# EAGLE design cnc-controller (EAGLE 6.4)

## Sheet 1 of 6
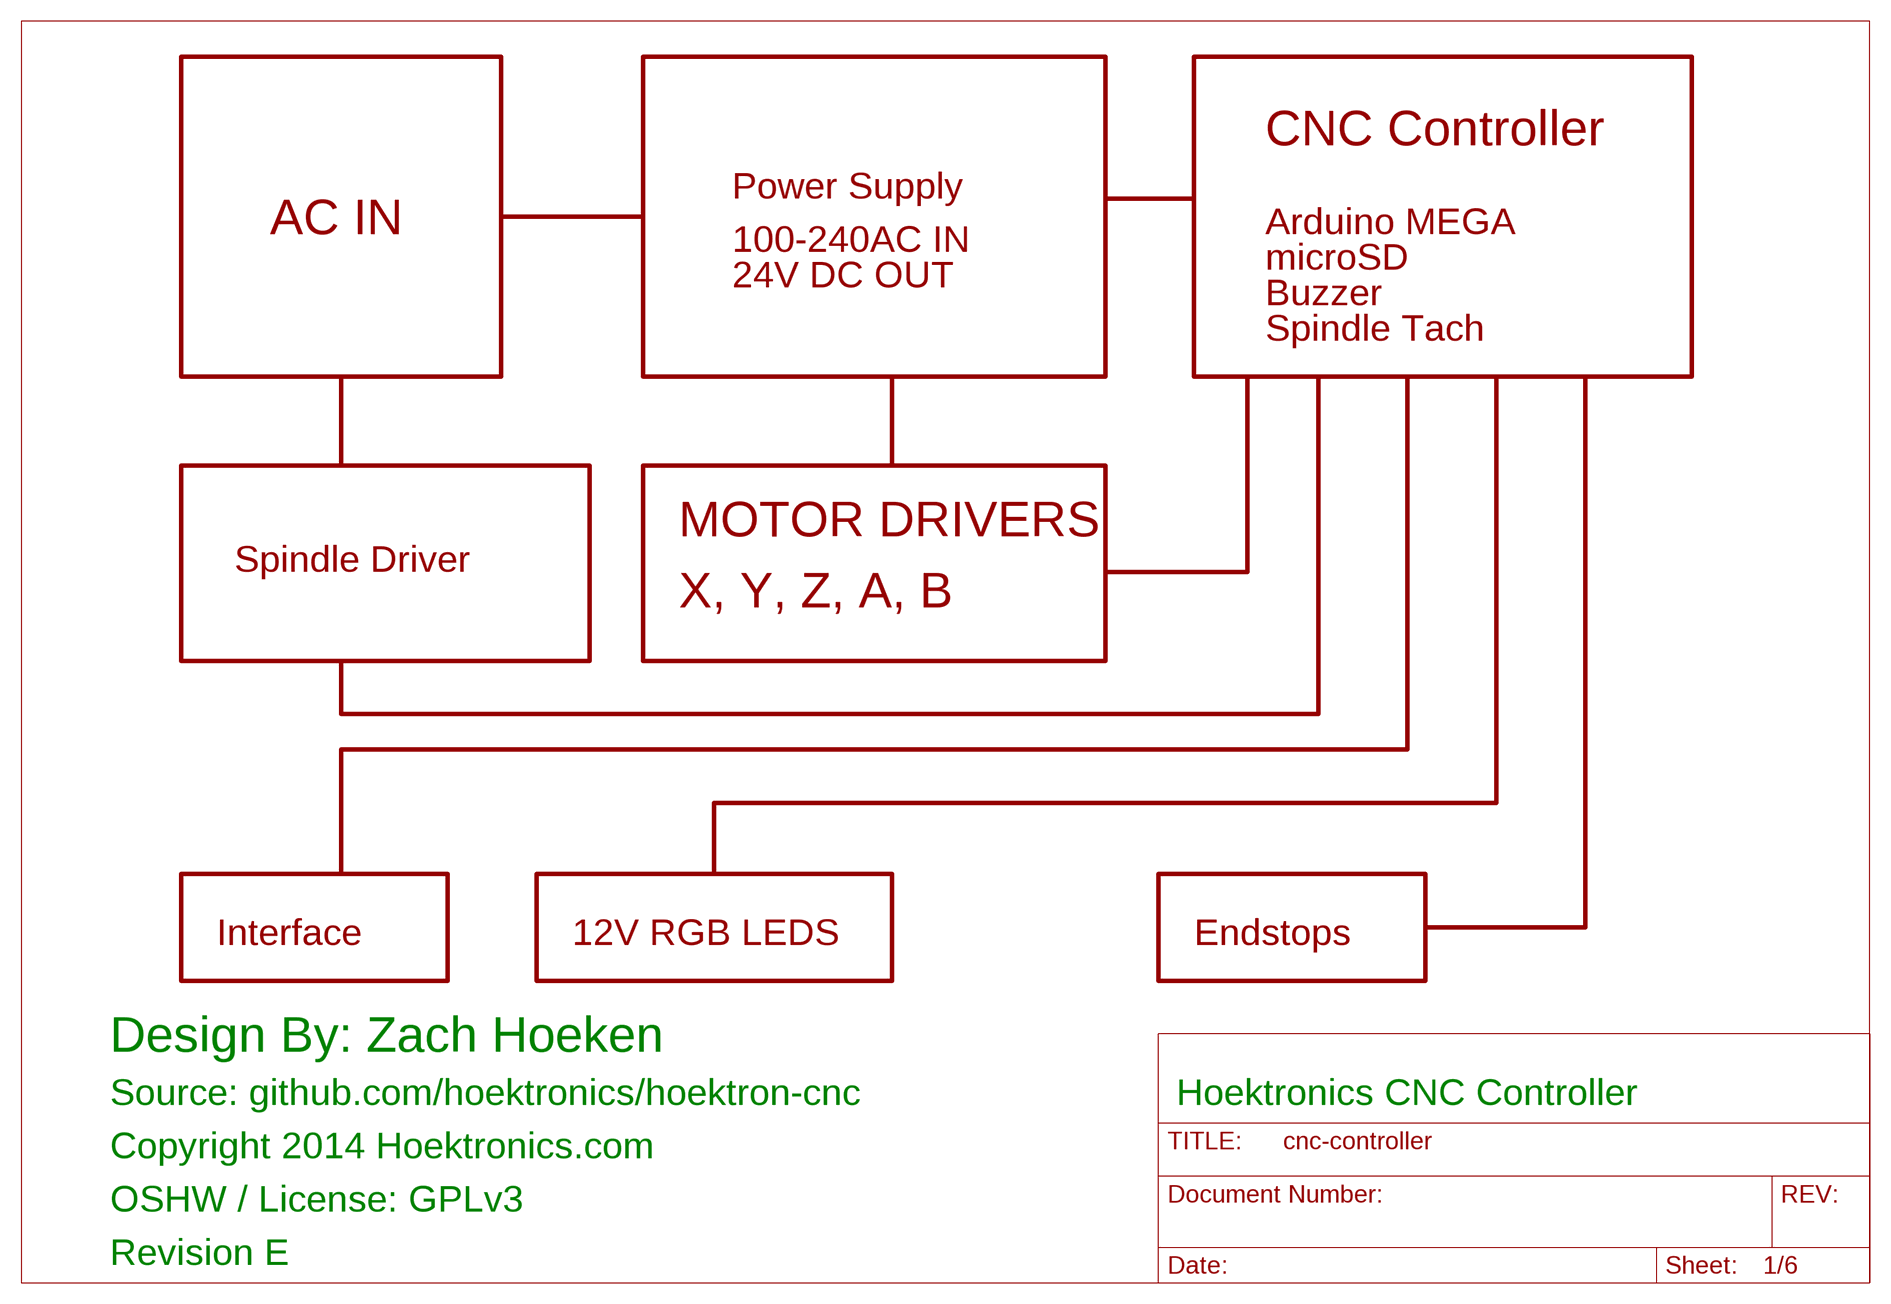
[diagram p0: schematic, sheet 1]

### Notes on the sheet
- CNC Controller
- Power Supply
- AC IN | Arduino MEGA
- 100-240AC IN
- microSD
- 24V DC OUT
- Buzzer
- Spindle Tach
- MOTOR DRIVERS
- Spindle Driver
- X, Y, Z, A, B
- Interface | 12V RGB LEDS | Endstops
- Design By: Zach Hoeken
- Source: github.com/hoektronics/hoektron-cnc | Hoektronics CNC Controller
- Copyright 2014 Hoektronics.com
- OSHW / License: GPLv3
- Revision E

## Sheet 2 of 6
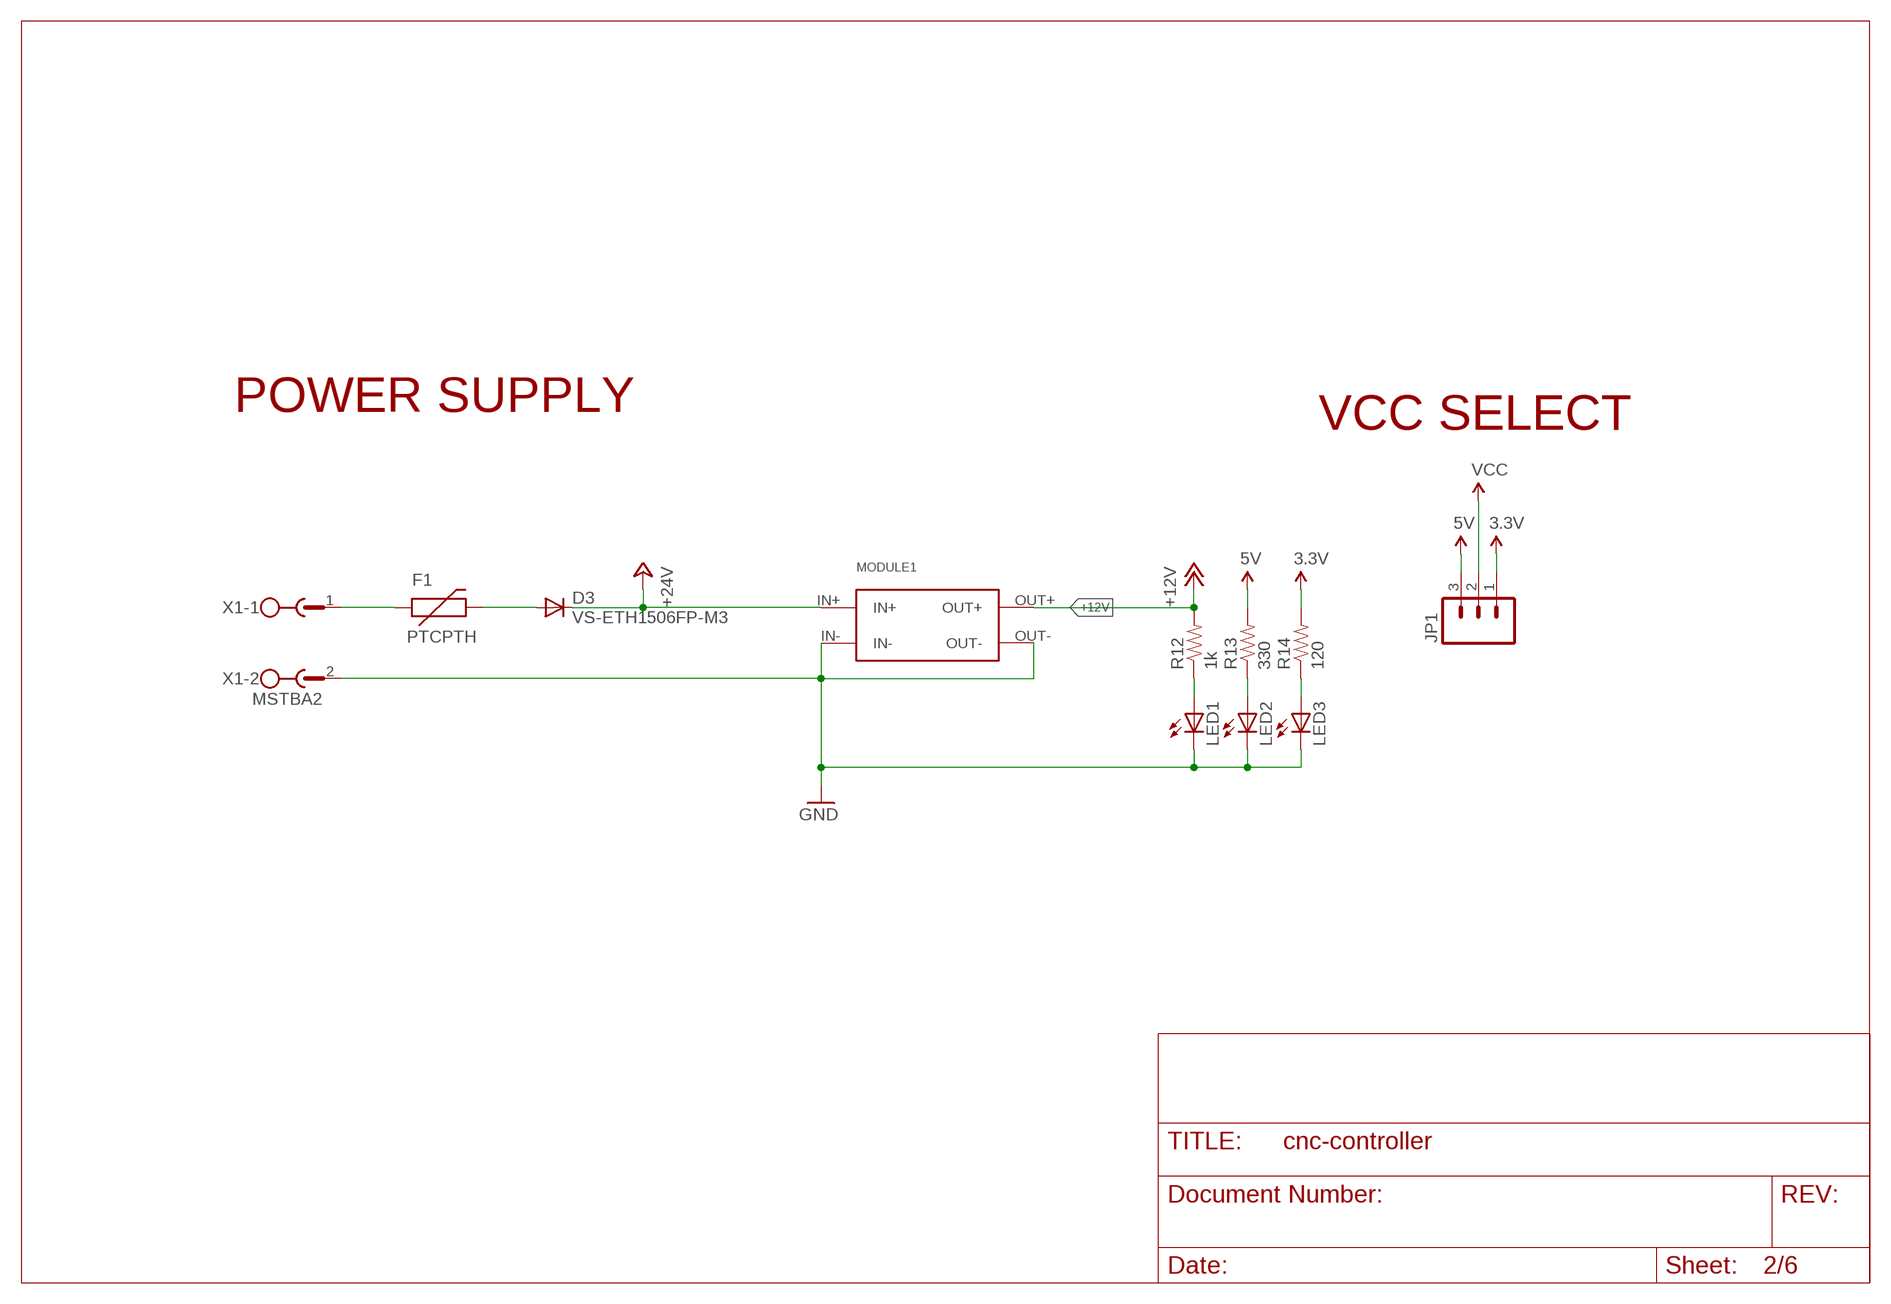
[diagram p1: schematic, sheet 2]

### Parts
D3  VS-ETH1506FP-M3  DIODE-SMB  [SMB]
F1  PTCPTH  [PTC]
JP1  M03PTH  [1X03]
LED1  LED0805  [0805-LED]
LED2  LED0805  [0805-LED]
LED3  LED0805  [0805-LED]
MODULE1  DC-DC-CONVERTER  [DC-DC-MODULE]
R12  1k  RESISTOR0603  [0603-RC]
R13  330  RESISTOR0603  [0603-RC]
R14  120  RESISTOR0603  [0603-RC]
X1  MSTBA2  [MSTBA2]

### Nets
3.3V: JP1.1 R14.2 ; also sheet 3
5V: JP1.3 R13.2 ; also sheet 3,4,5
+12V [power]: MODULE1.OUT+ R12.2 ; also sheet 3,6
+24V [power]: D3.C MODULE1.IN+
GND [gnd]: LED1.C LED2.C LED3.C MODULE1.IN- MODULE1.OUT- X1.2 ; also sheet 3,4,5,6
N$27: LED1.A R12.1
N$28 [power]: D3.A F1.P$2
N$32: LED2.A R13.1
N$33: LED3.A R14.1
PRE24 [power]: F1.P$1 X1.1
VCC: JP1.2 ; also sheet 4,5,6

### Notes on the sheet
- POWER SUPPLY
- VCC SELECT

## Sheet 3 of 6
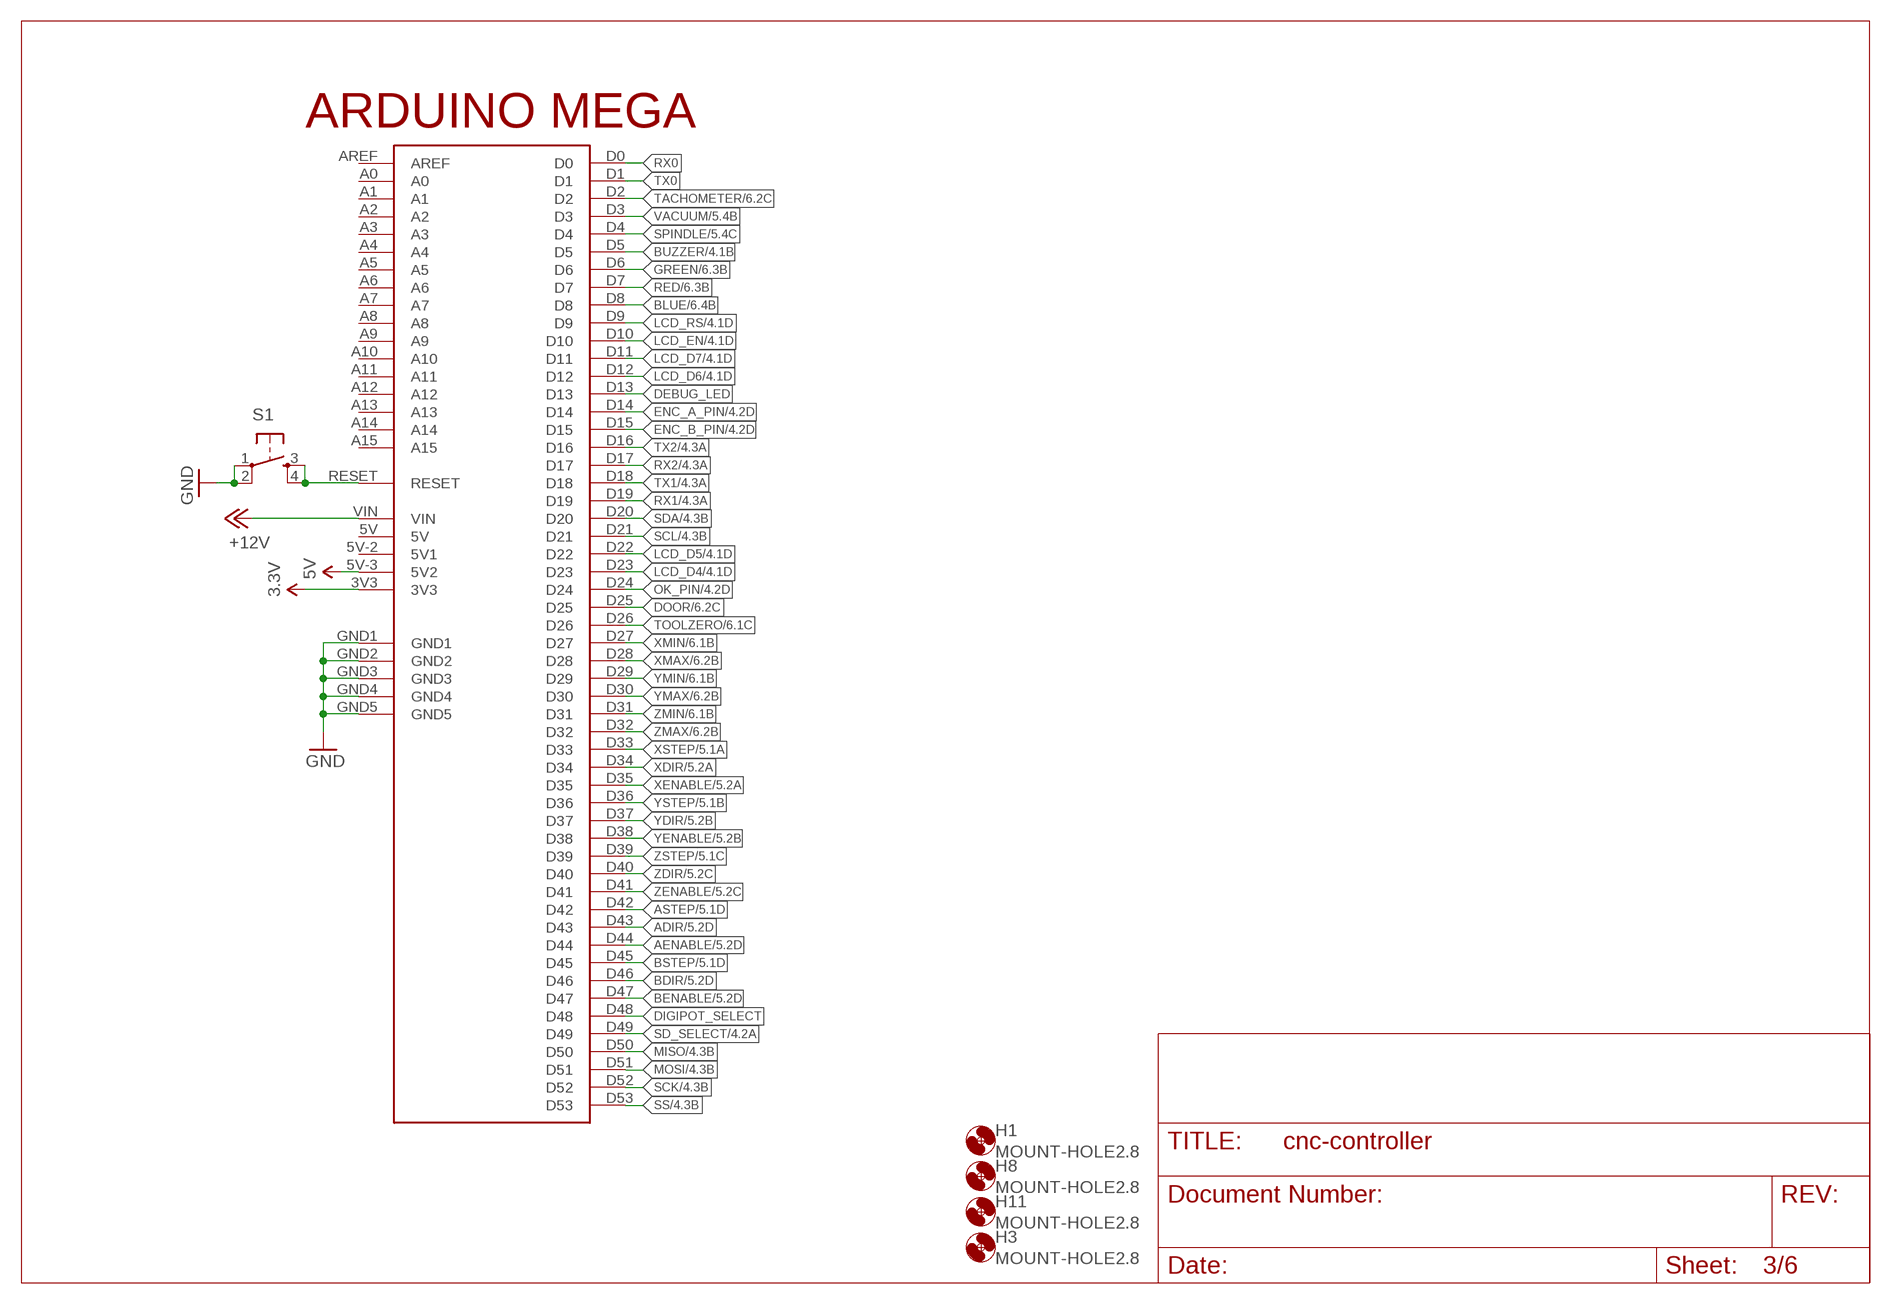
[diagram p2: schematic, sheet 3]

### Parts
H1  MOUNT-HOLE2.8  [2,8]
H3  MOUNT-HOLE2.8  [2,8]
H8  MOUNT-HOLE2.8  [2,8]
H11  MOUNT-HOLE2.8  [2,8]
S1  TAC_SWITCHSMD  [TACTILE_SWITCH_SMD]
U$1  ARDUINO-MEGA  [ARDUINO-MEGA]

### Nets
3.3V: U$1.3V3 ; also sheet 2
5V: U$1.5V-3(5V2) ; also sheet 2,4,5
+12V [power]: U$1.VIN ; also sheet 2,6
ADIR: U$1.D43 ; also sheet 5
AENABLE: U$1.D44 ; also sheet 5
ASTEP: U$1.D42 ; also sheet 5
BDIR: U$1.D46 ; also sheet 5
BENABLE: U$1.D47 ; also sheet 5
BLUE: U$1.D8 ; also sheet 6
BSTEP: U$1.D45 ; also sheet 5
BUZZER: U$1.D5 ; also sheet 4
DEBUG_LED: U$1.D13
DIGIPOT_SELECT: U$1.D48
DOOR: U$1.D25 ; also sheet 6
ENC_A_PIN: U$1.D14 ; also sheet 4
ENC_B_PIN: U$1.D15 ; also sheet 4
GND [gnd]: S1.1 S1.2 U$1.GND1 U$1.GND2 U$1.GND3 U$1.GND4 U$1.GND5 ; also sheet 2,4,5,6
GREEN: U$1.D6 ; also sheet 6
LCD_D4: U$1.D23 ; also sheet 4
LCD_D5: U$1.D22 ; also sheet 4
LCD_D6: U$1.D12 ; also sheet 4
LCD_D7: U$1.D11 ; also sheet 4
LCD_EN: U$1.D10 ; also sheet 4
LCD_RS: U$1.D9 ; also sheet 4
MISO [signals]: U$1.D50 ; also sheet 4
MOSI [signals]: U$1.D51 ; also sheet 4
N$26: S1.3 S1.4 U$1.RESET
OK_PIN: U$1.D24 ; also sheet 4
RED: U$1.D7 ; also sheet 6
RX0: U$1.D0
RX1: U$1.D19 ; also sheet 4
RX2: U$1.D17 ; also sheet 4
SCK [signals]: U$1.D52 ; also sheet 4
SCL: U$1.D21 ; also sheet 4
SD_SELECT [signals]: U$1.D49 ; also sheet 4
SDA: U$1.D20 ; also sheet 4
SPINDLE: U$1.D4 ; also sheet 5
SS: U$1.D53 ; also sheet 4
TACHOMETER: U$1.D2 ; also sheet 6
TOOLZERO: U$1.D26 ; also sheet 6
TX0: U$1.D1
TX1: U$1.D18 ; also sheet 4
TX2: U$1.D16 ; also sheet 4
VACUUM: U$1.D3 ; also sheet 5
XDIR: U$1.D34 ; also sheet 5
XENABLE: U$1.D35 ; also sheet 5
XMAX: U$1.D28 ; also sheet 6
XMIN: U$1.D27 ; also sheet 6
XSTEP: U$1.D33 ; also sheet 5
YDIR: U$1.D37 ; also sheet 5
YENABLE: U$1.D38 ; also sheet 5
YMAX: U$1.D30 ; also sheet 6
YMIN: U$1.D29 ; also sheet 6
YSTEP: U$1.D36 ; also sheet 5
ZDIR: U$1.D40 ; also sheet 5
ZENABLE: U$1.D41 ; also sheet 5
ZMAX: U$1.D32 ; also sheet 6
ZMIN: U$1.D31 ; also sheet 6
ZSTEP: U$1.D39 ; also sheet 5
Unconnected: U$1.5V U$1.5V-2(5V1) U$1.A0 U$1.A1 U$1.A2 U$1.A3 U$1.A4 U$1.A5 U$1.A6 U$1.A7 U$1.A8 U$1.A9 U$1.A10 U$1.A11 U$1.A12 U$1.A13 U$1.A14 U$1.A15 U$1.AREF

### Notes on the sheet
- ARDUINO MEGA

## Sheet 4 of 6
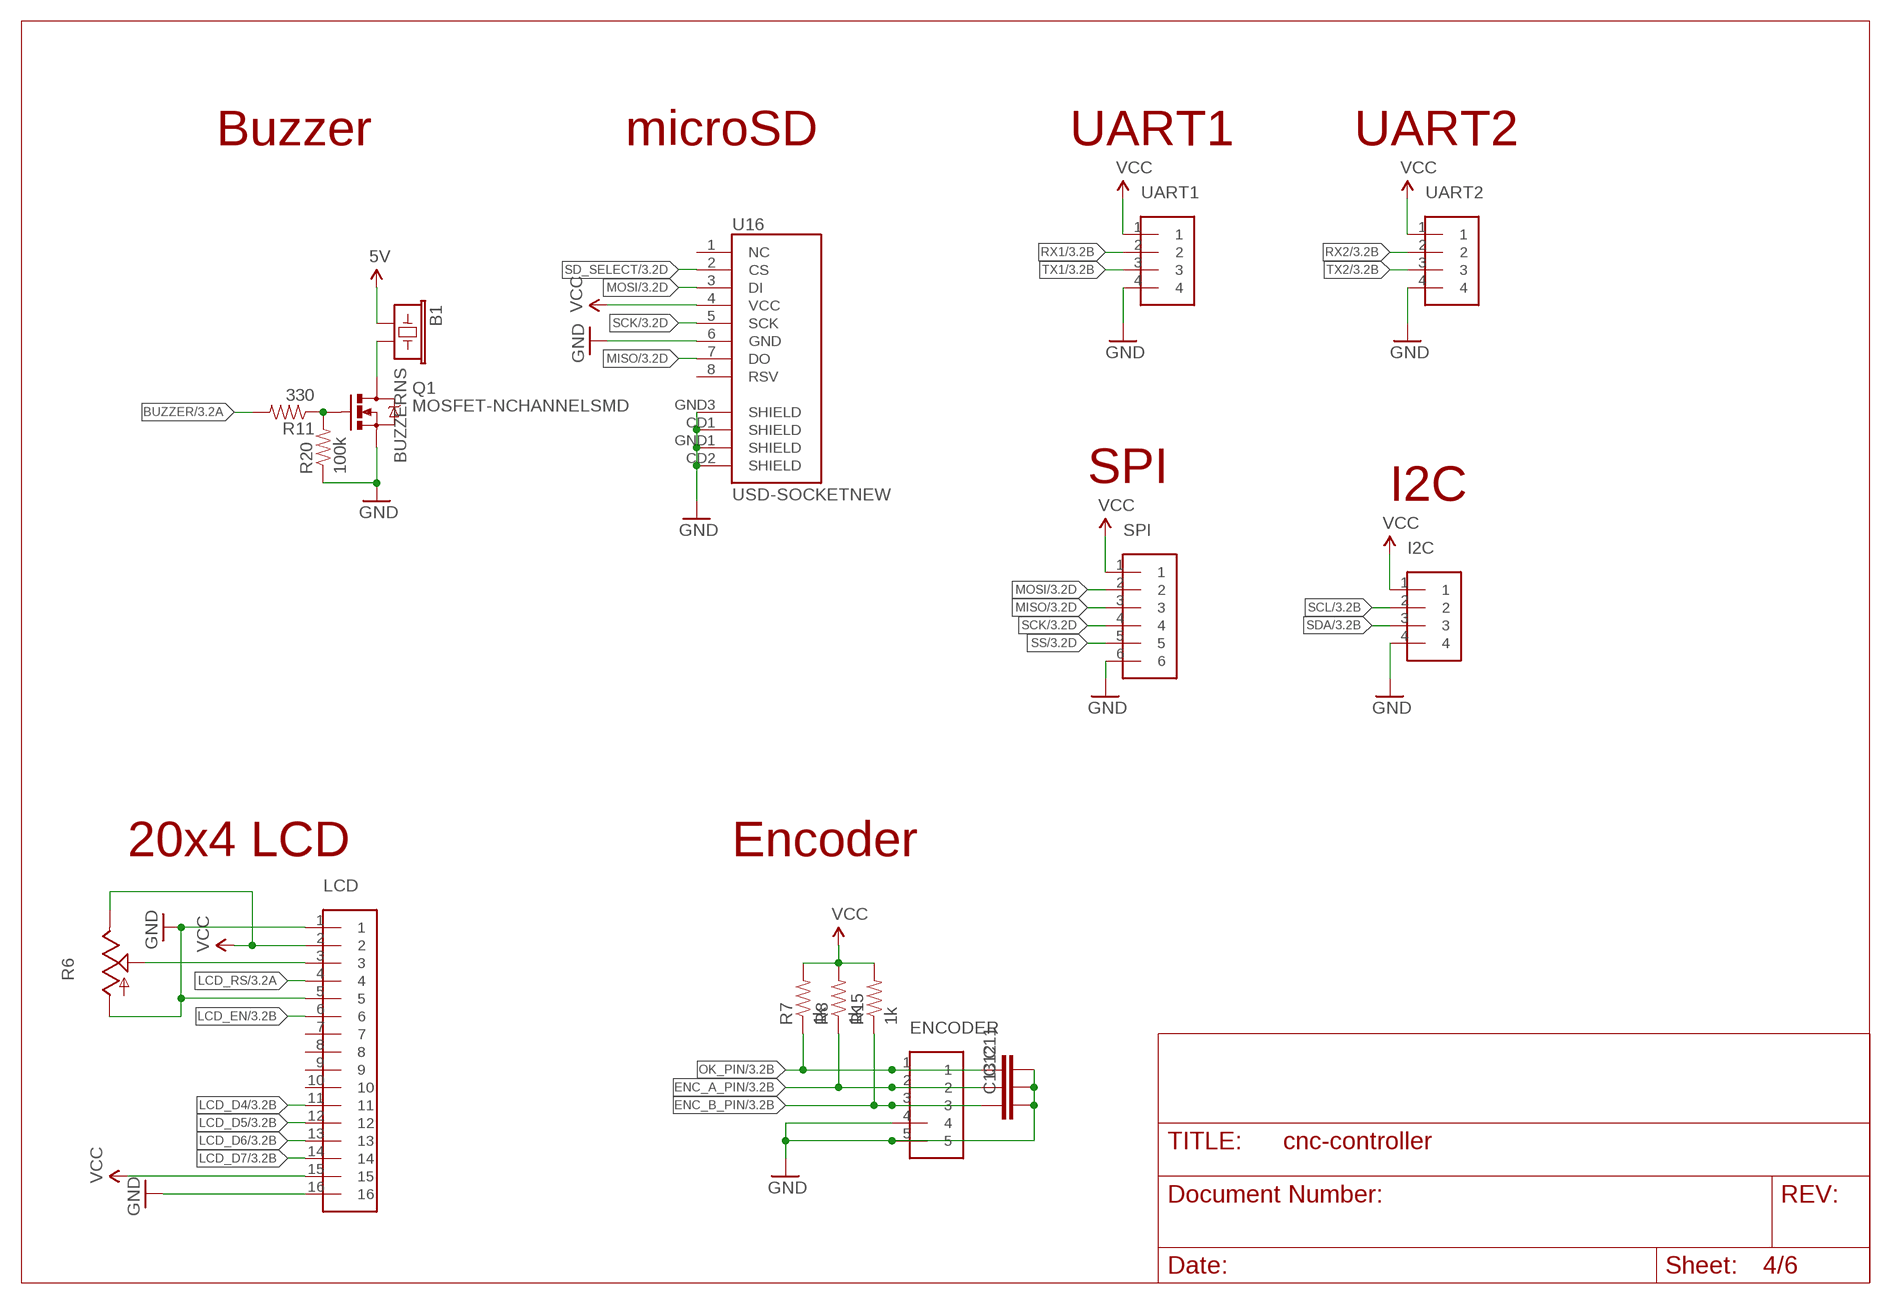
[diagram p3: schematic, sheet 4]

### Parts
B1  BUZZERNS  [BUZZER-12MM-NS]
C11  CAPACITOR0805  [0805-RC]
C12  CAPACITOR0805  [0805-RC]
C13  CAPACITOR0805  [0805-RC]
ENCODER  CONN-5  [XH-5]
I2C  CONN-4  [XH-4]
LCD  CONN-16  [XH-16]
Q1  MOSFET-NCHANNELSMD  [SOT23-3]
R6  TRIM_US-B25P  [B25P]
R7  1k  RESISTOR0805  [0805-RC]
R8  1k  RESISTOR0805  [0805-RC]
R11  330  RESISTOR0603  [0603-RC]
R15  1k  RESISTOR0805  [0805-RC]
R20  100k  RESISTOR0603  [0603-RC]
SPI  CONN-6  [XH-6]
U16  USD-SOCKETNEW  [MICRO-SD-SOCKET-PP]
UART1  CONN-4  [XH-4]
UART2  CONN-4  [XH-4]

### Nets
5V: B1.+ ; also sheet 2,3,5
BUZZER: R11.2 ; also sheet 3
ENC_A_PIN: C12.1 ENCODER.2 R8.1 ; also sheet 3
ENC_B_PIN: C13.1 ENCODER.3 R15.1 ; also sheet 3
GND [gnd]: C11.2 C12.2 C13.2 ENCODER.4 ENCODER.5 I2C.4 LCD.1 LCD.5 LCD.16 Q1.2(S) R6.A R20.1 SPI.6 U16.6(GND) U16.CD1(SHIELD) U16.CD2(SHIELD) U16.GND1(SHIELD) U16.GND3(SHIELD) UART1.4 UART2.4 ; also sheet 2,3,5,6
LCD_D4: LCD.11 ; also sheet 3
LCD_D5: LCD.12 ; also sheet 3
LCD_D6: LCD.13 ; also sheet 3
LCD_D7: LCD.14 ; also sheet 3
LCD_EN: LCD.6 ; also sheet 3
LCD_RS: LCD.4 ; also sheet 3
MISO [signals]: SPI.3 U16.7(DO) ; also sheet 3
MOSI [signals]: SPI.2 U16.3(DI) ; also sheet 3
N$1: LCD.3 R6.S
N$25: Q1.1(G) R11.1 R20.2
N$38 [signals]: B1.- Q1.3(D)
OK_PIN: C11.1 ENCODER.1 R7.1 ; also sheet 3
RX1: UART1.2 ; also sheet 3
RX2: UART2.2 ; also sheet 3
SCK [signals]: SPI.4 U16.5(SCK) ; also sheet 3
SCL: I2C.2 ; also sheet 3
SD_SELECT [signals]: U16.2(CS) ; also sheet 3
SDA: I2C.3 ; also sheet 3
SS: SPI.5 ; also sheet 3
TX1: UART1.3 ; also sheet 3
TX2: UART2.3 ; also sheet 3
VCC: I2C.1 LCD.2 LCD.15 R6.E R7.2 R8.2 R15.2 SPI.1 U16.4(VCC) UART1.1 UART2.1 ; also sheet 2,5,6
Unconnected: LCD.7 LCD.8 LCD.9 LCD.10 U16.1(NC) U16.8(RSV)

### Notes on the sheet
- Buzzer | microSD | UART1 | UART2
- SPI
- I2C
- 20x4 LCD | Encoder

## Sheet 5 of 6
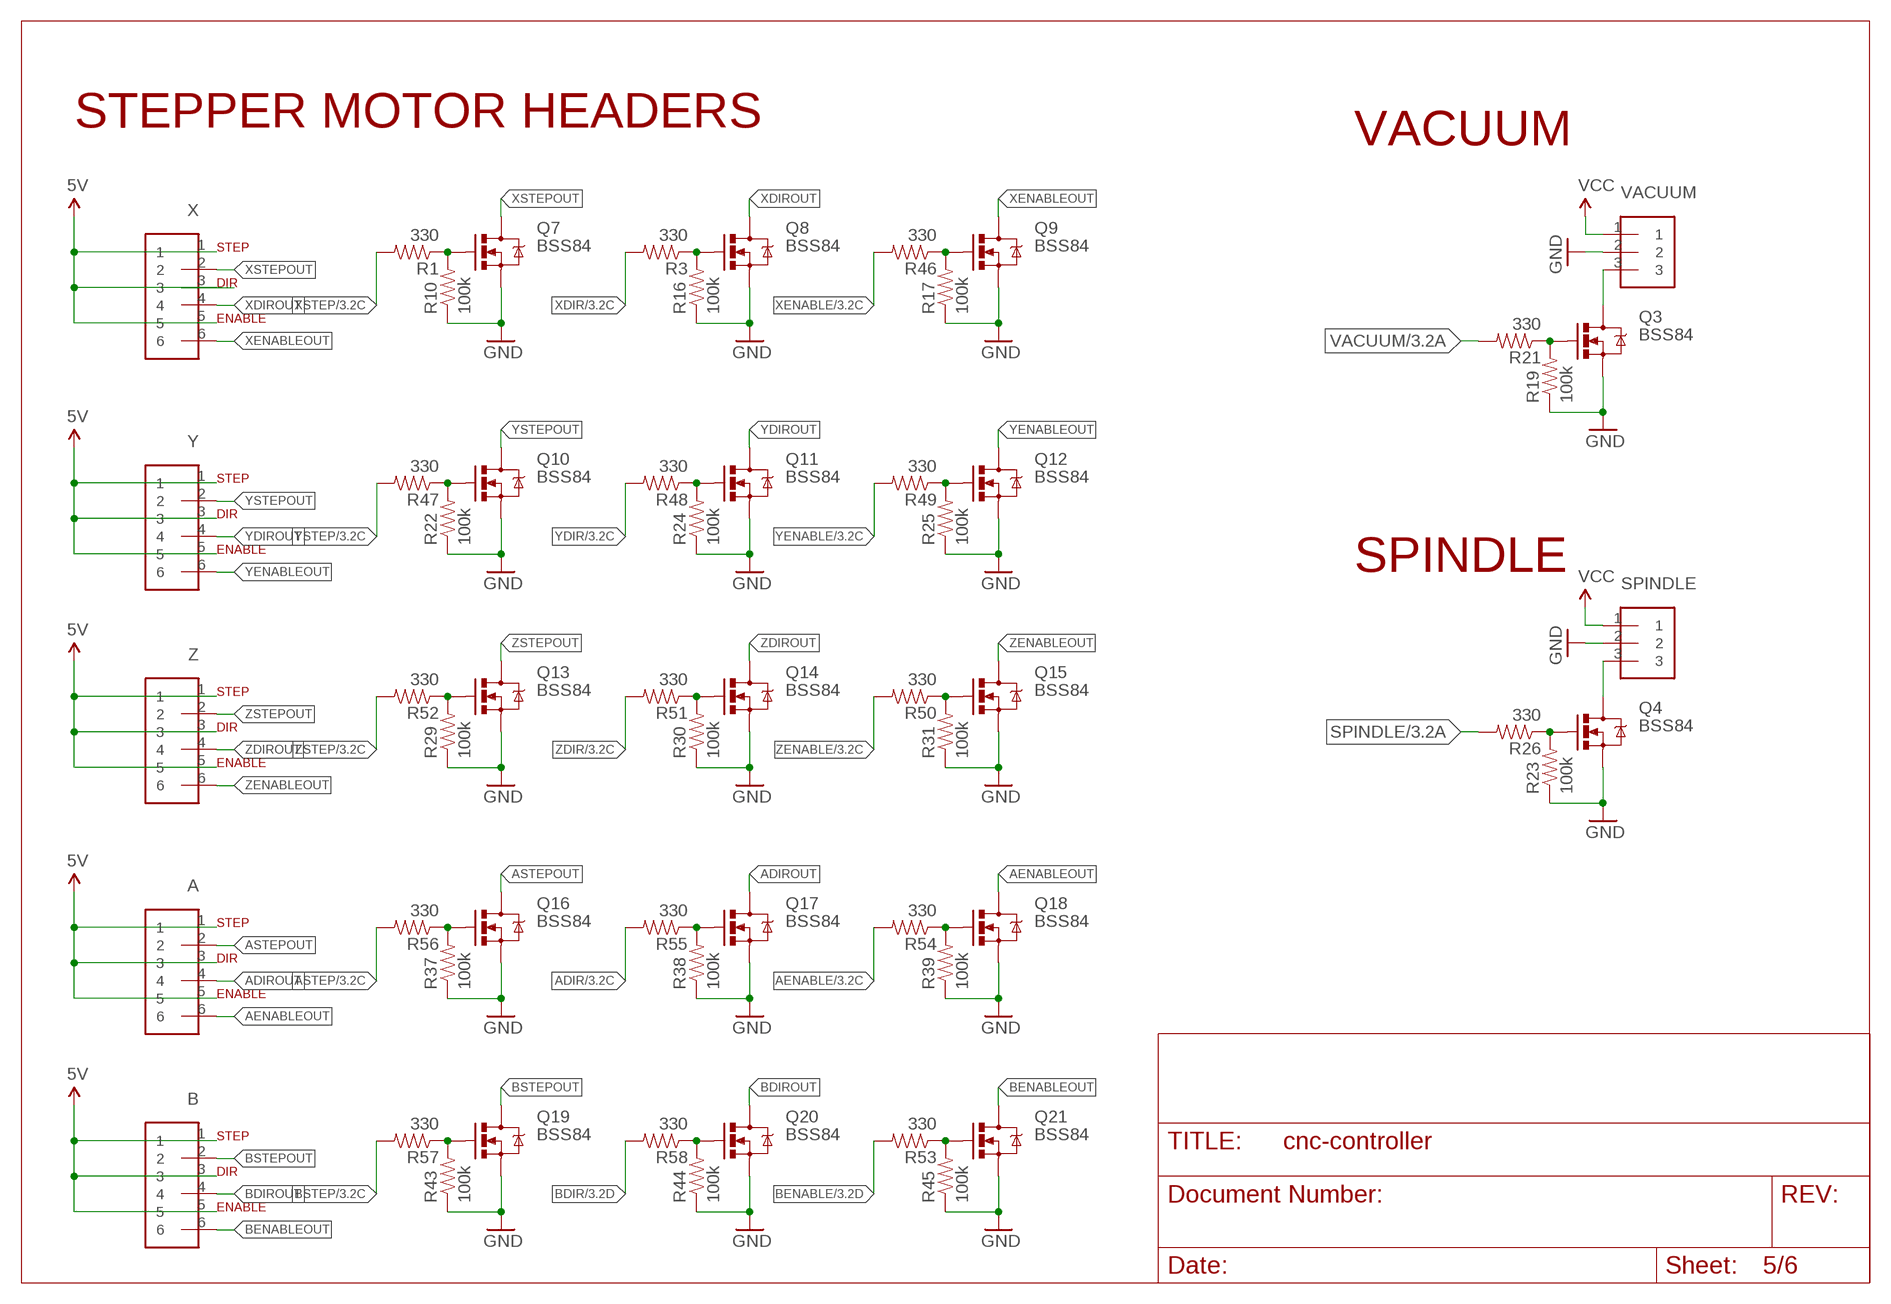
[diagram p4: schematic, sheet 5]

### Parts
A  CONN-6  [XH-6]
B  CONN-6  [XH-6]
Q3  BSS84  MOSFET-NCHANNELSMD  [SOT23-3]
Q4  BSS84  MOSFET-NCHANNELSMD  [SOT23-3]
Q7  BSS84  MOSFET-NCHANNELSMD  [SOT23-3]
Q8  BSS84  MOSFET-NCHANNELSMD  [SOT23-3]
Q9  BSS84  MOSFET-NCHANNELSMD  [SOT23-3]
Q10  BSS84  MOSFET-NCHANNELSMD  [SOT23-3]
Q11  BSS84  MOSFET-NCHANNELSMD  [SOT23-3]
Q12  BSS84  MOSFET-NCHANNELSMD  [SOT23-3]
Q13  BSS84  MOSFET-NCHANNELSMD  [SOT23-3]
Q14  BSS84  MOSFET-NCHANNELSMD  [SOT23-3]
Q15  BSS84  MOSFET-NCHANNELSMD  [SOT23-3]
Q16  BSS84  MOSFET-NCHANNELSMD  [SOT23-3]
Q17  BSS84  MOSFET-NCHANNELSMD  [SOT23-3]
Q18  BSS84  MOSFET-NCHANNELSMD  [SOT23-3]
Q19  BSS84  MOSFET-NCHANNELSMD  [SOT23-3]
Q20  BSS84  MOSFET-NCHANNELSMD  [SOT23-3]
Q21  BSS84  MOSFET-NCHANNELSMD  [SOT23-3]
R1  330  RESISTOR0603  [0603-RC]
R3  330  RESISTOR0603  [0603-RC]
R10  100k  RESISTOR0603  [0603-RC]
R16  100k  RESISTOR0603  [0603-RC]
R17  100k  RESISTOR0603  [0603-RC]
R19  100k  RESISTOR0603  [0603-RC]
R21  330  RESISTOR0603  [0603-RC]
R22  100k  RESISTOR0603  [0603-RC]
R23  100k  RESISTOR0603  [0603-RC]
R24  100k  RESISTOR0603  [0603-RC]
R25  100k  RESISTOR0603  [0603-RC]
R26  330  RESISTOR0603  [0603-RC]
R29  100k  RESISTOR0603  [0603-RC]
R30  100k  RESISTOR0603  [0603-RC]
R31  100k  RESISTOR0603  [0603-RC]
R37  100k  RESISTOR0603  [0603-RC]
R38  100k  RESISTOR0603  [0603-RC]
R39  100k  RESISTOR0603  [0603-RC]
R43  100k  RESISTOR0603  [0603-RC]
R44  100k  RESISTOR0603  [0603-RC]
R45  100k  RESISTOR0603  [0603-RC]
R46  330  RESISTOR0603  [0603-RC]
R47  330  RESISTOR0603  [0603-RC]
R48  330  RESISTOR0603  [0603-RC]
R49  330  RESISTOR0603  [0603-RC]
R50  330  RESISTOR0603  [0603-RC]
R51  330  RESISTOR0603  [0603-RC]
R52  330  RESISTOR0603  [0603-RC]
R53  330  RESISTOR0603  [0603-RC]
R54  330  RESISTOR0603  [0603-RC]
R55  330  RESISTOR0603  [0603-RC]
R56  330  RESISTOR0603  [0603-RC]
R57  330  RESISTOR0603  [0603-RC]
R58  330  RESISTOR0603  [0603-RC]
SPINDLE  CONN-3XH-3  [XH-3]
VACUUM  CONN-3XH-3  [XH-3]
X  CONN-6  [XH-6]
Y  CONN-6  [XH-6]
Z  CONN-6  [XH-6]

### Nets
5V: A.1 A.3 A.5 B.1 B.3 B.5 X.1 X.3 X.5 Y.1 Y.3 Y.5 Z.1 Z.3 Z.5 ; also sheet 2,3,4
ADIR: R55.2 ; also sheet 3
ADIROUT: A.4 Q17.3(D)
AENABLE: R54.2 ; also sheet 3
AENABLEOUT: A.6 Q18.3(D)
ASTEP: R56.2 ; also sheet 3
ASTEPOUT: A.2 Q16.3(D)
BDIR: R58.2 ; also sheet 3
BDIROUT: B.4 Q20.3(D)
BENABLE: R53.2 ; also sheet 3
BENABLEOUT: B.6 Q21.3(D)
BSTEP: R57.2 ; also sheet 3
BSTEPOUT: B.2 Q19.3(D)
GND [gnd]: Q3.2(S) Q4.2(S) Q7.2(S) Q8.2(S) Q9.2(S) Q10.2(S) Q11.2(S) Q12.2(S) Q13.2(S) Q14.2(S) Q15.2(S) Q16.2(S) Q17.2(S) Q18.2(S) Q19.2(S) Q20.2(S) Q21.2(S) R10.1 R16.1 R17.1 R19.1 R22.1 R23.1 R24.1 R25.1 R29.1 R30.1 R31.1 R37.1 R38.1 R39.1 R43.1 R44.1 R45.1 SPINDLE.2 VACUUM.2 ; also sheet 2,3,4,6
N$5: Q10.1(G) R22.2 R47.1
N$10: Q3.1(G) R19.2 R21.1
N$11: Q4.1(G) R23.2 R26.1
N$12: Q3.3(D) VACUUM.3
N$13: Q4.3(D) SPINDLE.3
N$18: Q19.1(G) R43.2 R57.1
N$19: Q20.1(G) R44.2 R58.1
N$20: Q21.1(G) R45.2 R53.1
N$21: Q16.1(G) R37.2 R56.1
N$22: Q17.1(G) R38.2 R55.1
N$23: Q18.1(G) R39.2 R54.1
N$24: Q11.1(G) R24.2 R48.1
N$29: Q12.1(G) R25.2 R49.1
N$30: Q15.1(G) R31.2 R50.1
N$31: Q14.1(G) R30.2 R51.1
N$35: Q13.1(G) R29.2 R52.1
SPINDLE: R26.2 ; also sheet 3
VACUUM: R21.2 ; also sheet 3
VCC: SPINDLE.1 VACUUM.1 ; also sheet 2,4,6
XDIR: R3.2 ; also sheet 3
XDIRIN [signals]: Q8.1(G) R3.1 R16.2
XDIROUT: Q8.3(D) X.4
XENABLE: R46.2 ; also sheet 3
XENABLEIN [signals]: Q9.1(G) R17.2 R46.1
XENABLEOUT: Q9.3(D) X.6
XSTEP: R1.2 ; also sheet 3
XSTEPIN [signals]: Q7.1(G) R1.1 R10.2
XSTEPOUT: Q7.3(D) X.2
YDIR: R48.2 ; also sheet 3
YDIROUT: Q11.3(D) Y.4
YENABLE: R49.2 ; also sheet 3
YENABLEOUT: Q12.3(D) Y.6
YSTEP: R47.2 ; also sheet 3
YSTEPOUT: Q10.3(D) Y.2
ZDIR: R51.2 ; also sheet 3
ZDIROUT: Q14.3(D) Z.4
ZENABLE: R50.2 ; also sheet 3
ZENABLEOUT: Q15.3(D) Z.6
ZSTEP: R52.2 ; also sheet 3
ZSTEPOUT: Q13.3(D) Z.2

### Notes on the sheet
- STEPPER MOTOR HEADERS
- VACUUM
- STEP
- DIR
- ENABLE
- STEP
- DIR
- ENABLE
- SPINDLE
- STEP
- DIR
- ENABLE
- STEP
- DIR
- ENABLE
- STEP
- DIR
- ENABLE

## Sheet 6 of 6
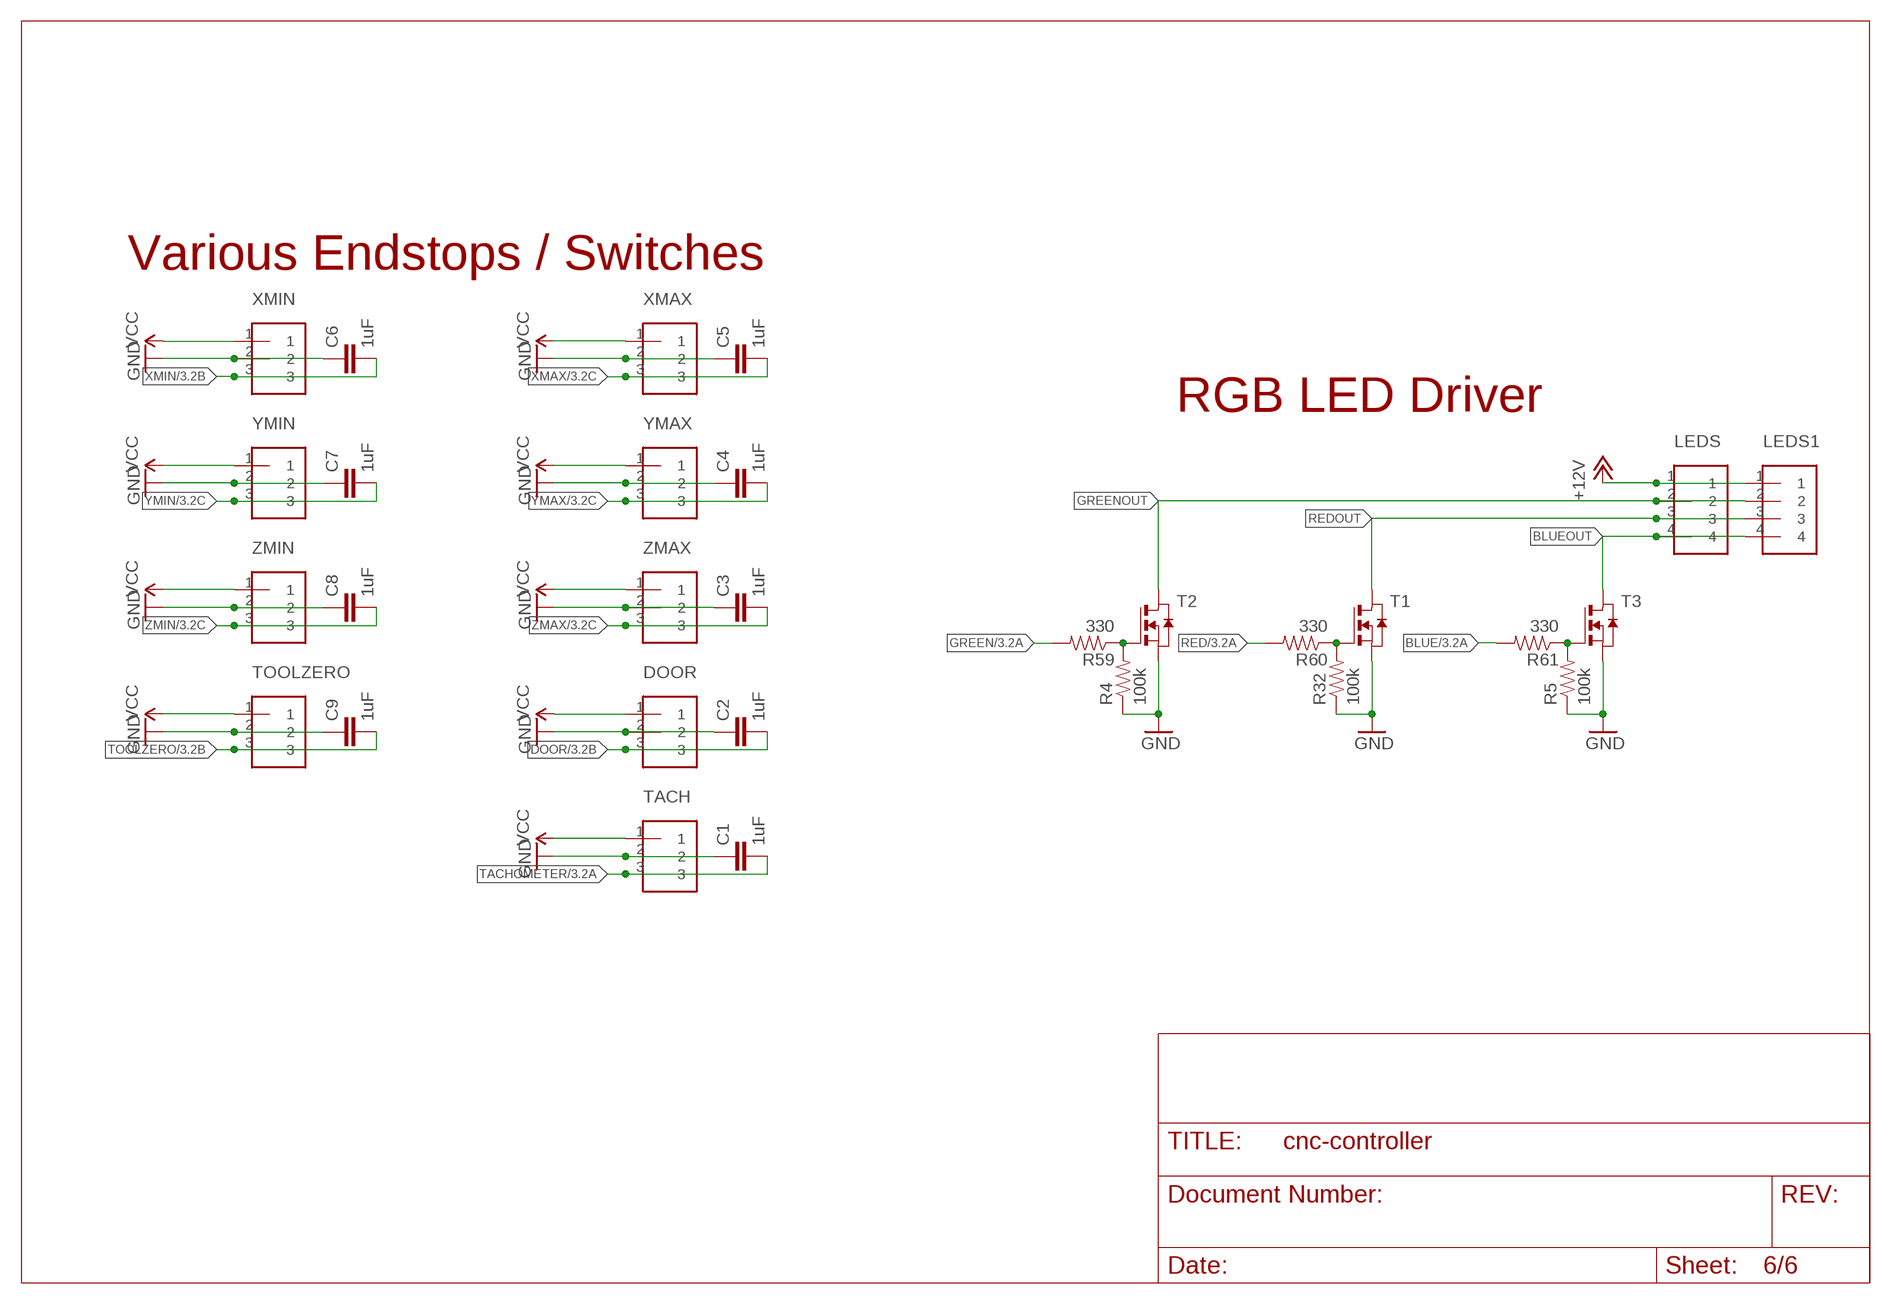
[diagram p5: schematic, sheet 6]

### Parts
C1  1uF  CAPACITOR0603  [0603-RC]
C2  1uF  CAPACITOR0603  [0603-RC]
C3  1uF  CAPACITOR0603  [0603-RC]
C4  1uF  CAPACITOR0603  [0603-RC]
C5  1uF  CAPACITOR0603  [0603-RC]
C6  1uF  CAPACITOR0603  [0603-RC]
C7  1uF  CAPACITOR0603  [0603-RC]
C8  1uF  CAPACITOR0603  [0603-RC]
C9  1uF  CAPACITOR0603  [0603-RC]
DOOR  CONN-3XH-3  [XH-3]
LEDS  CONN-4  [XH-4]
LEDS1  CONN-4  [XH-4]
R4  100k  RESISTOR0603  [0603-RC]
R5  100k  RESISTOR0603  [0603-RC]
R32  100k  RESISTOR0603  [0603-RC]
R59  330  RESISTOR0603  [0603-RC]
R60  330  RESISTOR0603  [0603-RC]
R61  330  RESISTOR0603  [0603-RC]
T1  NMOSSOT89  [SOT89]
T2  NMOSSOT89  [SOT89]
T3  NMOSSOT89  [SOT89]
TACH  CONN-3XH-3  [XH-3]
TOOLZERO  CONN-3XH-3  [XH-3]
XMAX  CONN-3XH-3  [XH-3]
XMIN  CONN-3XH-3  [XH-3]
YMAX  CONN-3XH-3  [XH-3]
YMIN  CONN-3XH-3  [XH-3]
ZMAX  CONN-3XH-3  [XH-3]
ZMIN  CONN-3XH-3  [XH-3]

### Nets
+12V [power]: LEDS1.1 LEDS.1 ; also sheet 2,3
BLUE: R61.2 ; also sheet 3
BLUEOUT: LEDS1.4 LEDS.4 T3.2(D)
DOOR: C2.2 DOOR.3 ; also sheet 3
GND [gnd]: C1.1 C2.1 C3.1 C4.1 C5.1 C6.1 C7.1 C8.1 C9.1 DOOR.2 R4.1 R5.1 R32.1 T1.3(S) T2.3(S) T3.3(S) TACH.2 TOOLZERO.2 XMAX.2 XMIN.2 YMAX.2 YMIN.2 ZMAX.2 ZMIN.2 ; also sheet 2,3,4,5
GREEN: R59.2 ; also sheet 3
GREENOUT: LEDS1.2 LEDS.2 T2.2(D)
N$37: R32.2 R60.1 T1.1(G)
N$43: R4.2 R59.1 T2.1(G)
N$44: R5.2 R61.1 T3.1(G)
RED: R60.2 ; also sheet 3
REDOUT: LEDS1.3 LEDS.3 T1.2(D)
TACHOMETER: C1.2 TACH.3 ; also sheet 3
TOOLZERO: C9.2 TOOLZERO.3 ; also sheet 3
VCC: DOOR.1 TACH.1 TOOLZERO.1 XMAX.1 XMIN.1 YMAX.1 YMIN.1 ZMAX.1 ZMIN.1 ; also sheet 2,4,5
XMAX: C5.2 XMAX.3 ; also sheet 3
XMIN: C6.2 XMIN.3 ; also sheet 3
YMAX: C4.2 YMAX.3 ; also sheet 3
YMIN: C7.2 YMIN.3 ; also sheet 3
ZMAX: C3.2 ZMAX.3 ; also sheet 3
ZMIN: C8.2 ZMIN.3 ; also sheet 3

### Notes on the sheet
- Various Endstops / Switches
- RGB LED Driver

## Library data of the parts
A B SPI X Y Z = Hoektronics:CONN-6
B1 = Hoektronics:BUZZER: Buzzer 12mm Spark Fun Electronics SKU : Comp-Buzzer
C1-C9 C11-C13 = Hoektronics:CAPACITOR: Capacitor Standard 0603 ceramic capacitor, and 0.1" leaded capacitor.
D3 = diode:DIODE-: DIODE
DOOR SPINDLE TACH TOOLZERO VACUUM XMAX XMIN YMAX YMIN ZMAX ZMIN = Hoektronics:CONN-3
ENCODER = Hoektronics:CONN-5
F1 = SparkFun:PTC: Resettable Fuse PTC Resettable Fuse. Spark Fun Electronics SKU : COM-08357
H1 H3 H8 H11 = holes:MOUNT-HOLE: MOUNTING HOLE with drill center marker
I2C LEDS LEDS1 UART1 UART2 = Hoektronics:CONN-4
JP1 = SparkFun:M03: Header 3 Standard 3-pin 0.1" header. Use with straight break away headers (SKU : PRT-00116), right angle break away headers (PRT-00553), swiss pins (PRT-00743), machine pins (PRT-00117), and female headers (PRT-00115). Molex polarized connector foot print use with SKU : PRT-08232 with associated crimp pins and housings.
LCD = Hoektronics:CONN-16
LED1-LED3 = Hoektronics:LED: LEDs Standard schematic elements and footprints for 5mm, 3mm, 1206, and 0603 sized LEDs. 5mm - Spark Fun Electronics SKU : COM-00529 (and others)
MODULE1 = Hoektronics:DC-DC-CONVERTER
Q1 Q3 Q4 Q7-Q21 = SparkFun:MOSFET-NCHANNEL
R1 R3-R5 R7 R8 R10-R17 R19-R26 R29-R32 R37-R39 R43-R61 = Hoektronics:RESISTOR: Resistor Basic schematic elements and footprints for 0603, 1206, and PTH 1/10th watt (small) resistors.
R6 = pot:TRIM_US-: POTENTIOMETER
S1 = SparkFun:TAC_SWITCH: Momentary Switch Button commonly used for reset or general input. Spark Fun Electronics SKU : COM-00097
T1-T3 = zetex:NMOSSOT89: MOS FET; OC_FARNELL: unknown; OC_NEWARK: unknown
U16 = SparkFun:USD-SOCKET: microSD Socket Push-push type uSD socket. Schematic element and footprint production proven. Spark Fun Electronics SKU : PRT-00127. tDoc lines correctly indicate media card edge positions when inserting (unlocked, locked, depressed).
U$1 = MakerBot:ARDUINO-MEGA
X1 = con-phoenix-508:MSTBA2: PHOENIX; MF: FARNELL; MPN: 1757242; OC_FARNELL: 3705171; OC_NEWARK: 71C4161

## Net classes
0 default: width 0.254 mm, clearance 0.254 mm
1 power: width 0.508 mm, clearance 0.254 mm
2 gnd: width 0.508 mm, clearance 0.254 mm
3 signals: width 0.254 mm, clearance 0.254 mm

## Board
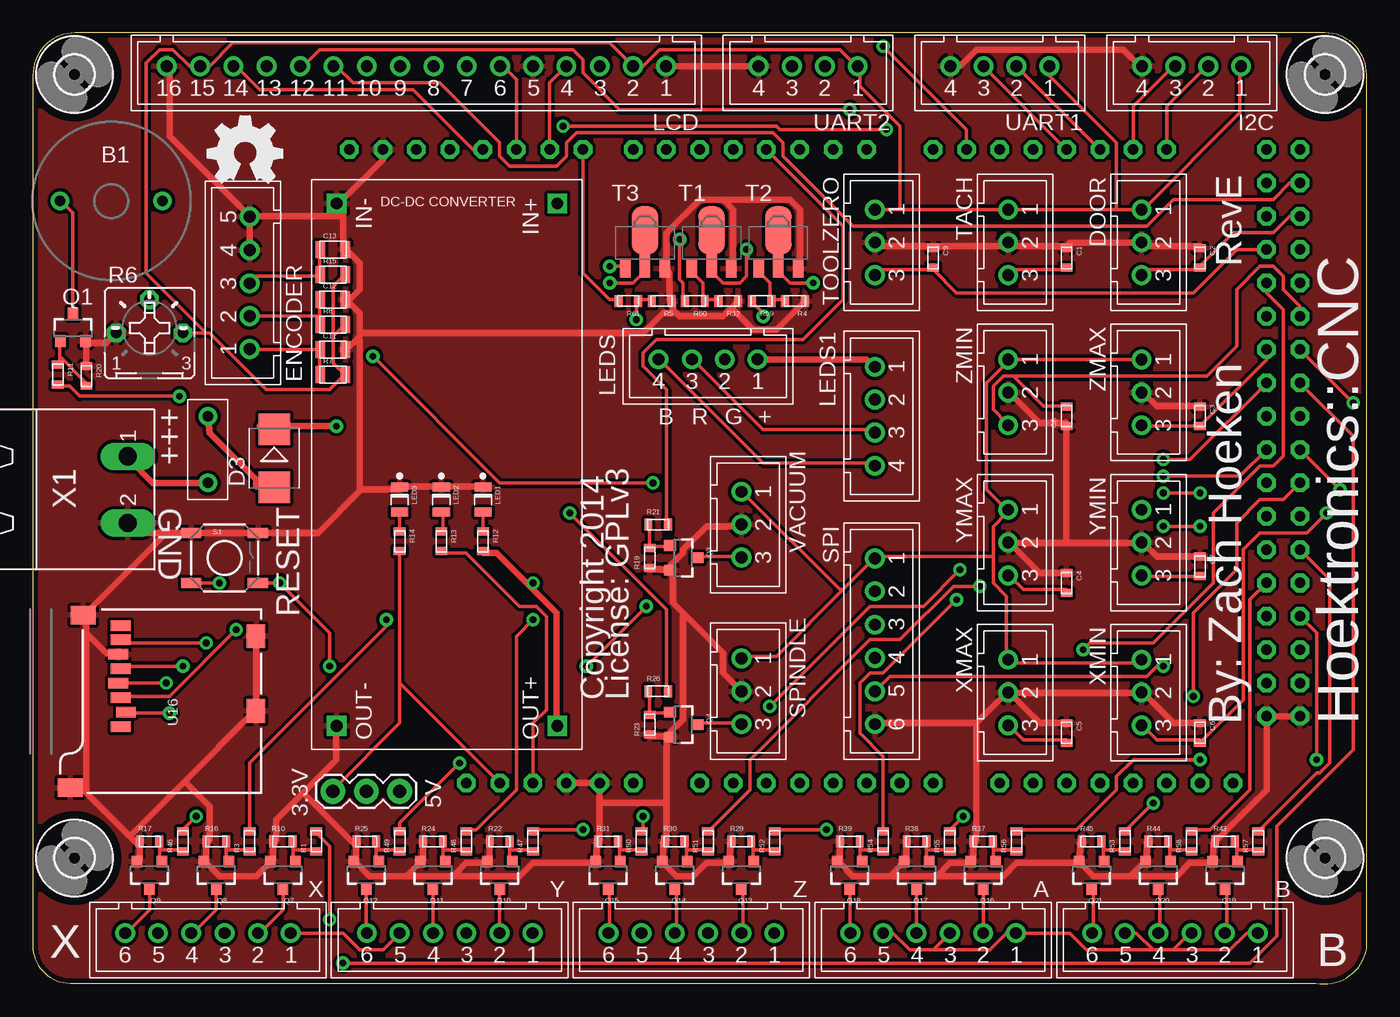
[diagram p6: board, top side]
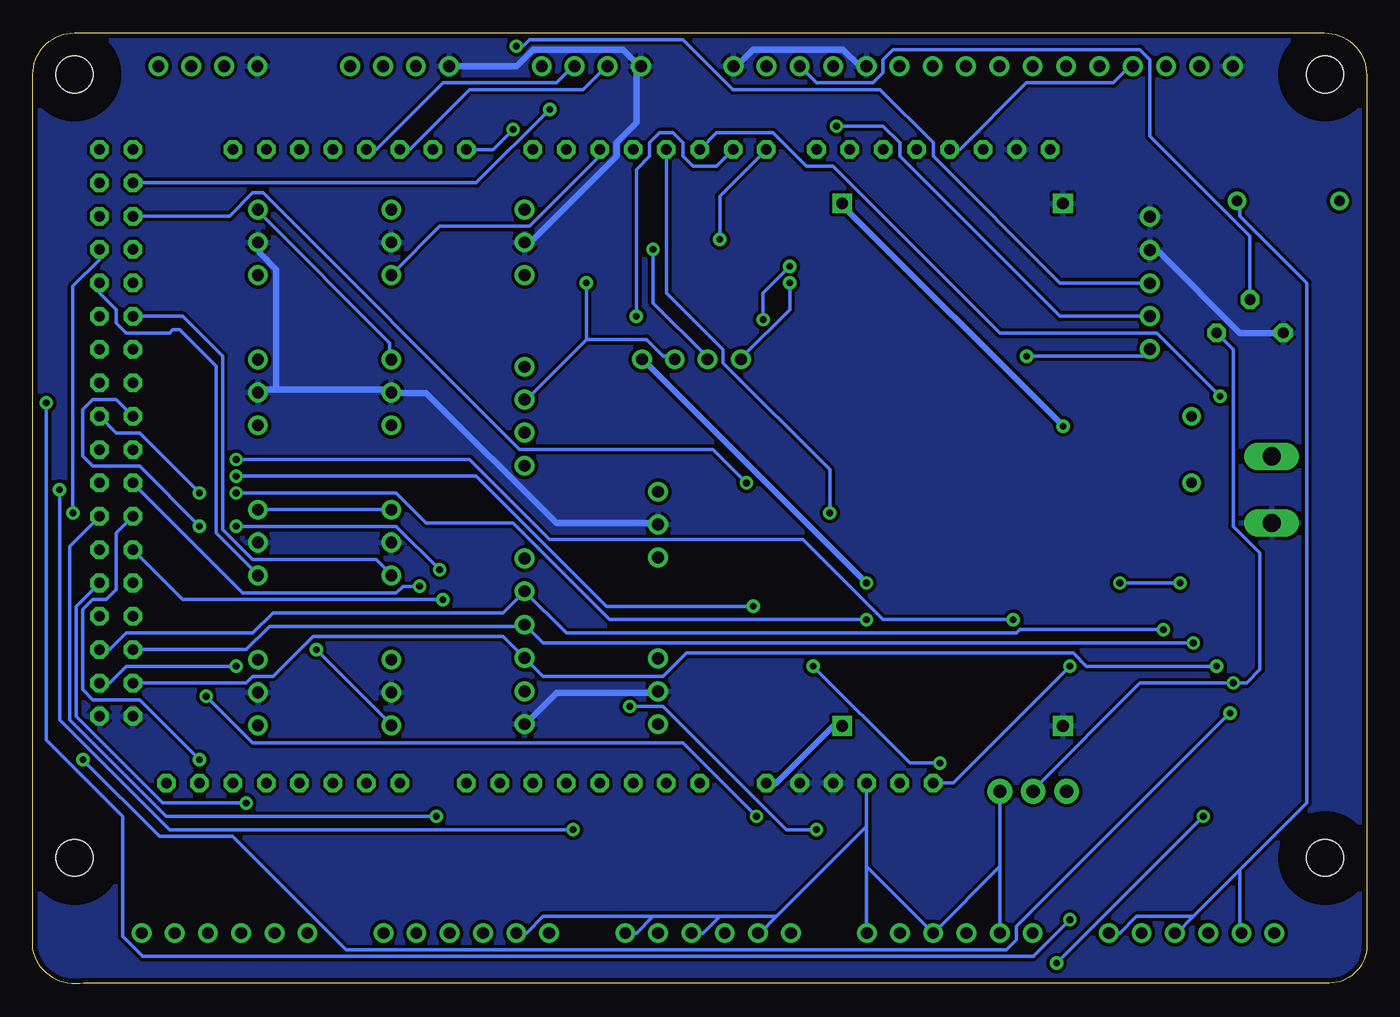
[diagram p7: board, bottom side, seen from below]

Size 101.6 x 72.45 mm. Coordinates in mm from the lower left corner, seen from the top.
Outline: 3.24,72.45 arc90 0,69.21 0,2.9 arc90 2.84,0.06 97.74,0.06 arc90 101.6,2.65 101.6,69.28 arc90 98.42,72.45 3.24,72.45
Copper layers (1*16): Top 0.035mm / dielectric 1.5mm / Bottom 0.035mm
Design rules "hoektronics *": minimum track width 8mil, minimum drill 20mil, track to track 8mil, track to pad 8mil, pad to pad 8mil, via to via 8mil, smd to smd 8mil, copper to edge 15mil, drill to drill 8mil, minimum pad ring 12mil, minimum via ring 10mil, stop-mask expansion 4mil, vias tented up to drill 25mil, thermal gap 10mil

### Footprints (pad centres in the part's own frame; a part is rotated, then mirrored left to right if it is on the bottom)
XH-6 = drill 0.9: 1 -6.31,0; 2 -3.81,0; 3 -1.27,0; 4 1.27,0; 5 3.81,0; 6 6.31,0
BUZZER-12MM-NS = drill 0.8: + 3.9,0; - -3.9,0
0603-RC = smd 0.6 x 0.9: 1 -0.75,0; 2 0.75,0
0805-RC = smd 0.7 x 1.3: 1 -0.95,0; 2 0.95,0
SMB = smd 2.4 x 2.4: A 2.2,0; C -2.2,0
XH-3 = drill 0.9: 1 -2.5,0; 2 0,0; 3 2.5,0
XH-5 = drill 0.9: 1 -3.77,0; 2 -1.27,0; 3 1.23,0; 4 3.77,0; 5 6.31,0
PTC = drill 0.8: P$1 -2.54,0; P$2 2.54,0
2,8 = hole 2.8: 0,0
XH-4 = drill 0.9: 1 -3.77,0; 2 -1.27,0; 3 1.23,0; 4 3.77,0
1X03 = drill 1.016 pad 1.88: 1 0,0; 2 2.54,0; 3 5.08,0
XH-16 = drill 0.9: 1 -6.31,0; 2 -3.81,0; 3 -1.27,0; 4 1.27,0; 5 3.81,0; 6 6.31,0; 7 8.85,0; 8 11.39,0; 9 13.93,0; 10 16.47,0; 11 19.01,0; 12 21.55,0; 13 24.09,0; 14 26.63,0; 15 29.17,0; 16 31.71,0
0805-LED = smd 0.7 x 1.3: A 0.95,0; C -0.95,0
DC-DC-MODULE = drill 0.9 square: IN+ -19.9,8.4; IN- -19.9,-8.4; OUT+ 19.9,8.4; OUT- 19.9,-8.4
SOT23-3 = smd 0.8 x 0.9: 1 -0.95,-1; 2 0.95,-1; 3 0,1.1
B25P = drill 0.813 octagon: A -2.54,0; E 2.54,0; S 0,2.54
TACTILE_SWITCH_SMD = smd 1.524 x 0.762: 1 -2.54,1.905; 2 2.54,1.905; 3 -2.54,-1.905; 4 2.54,-1.905
SOT89 = smd 0.8 x 1.4: 1 -1.499,-1.981; 3 1.499,-1.981 | smd 0.8 x 1.9: 2 0,-1.727 | smd 2.032 x 3.65: 2@1 0,0.94
MICRO-SD-SOCKET-PP = smd 0.8 x 1.5: 1 -8.94,10.7; 2 -7.84,10.3; 3 -6.74,10.7; 4 -5.64,10.9; 5 -4.54,10.7; 6 -3.44,10.9; 7 -2.34,10.7; 8 -1.24,10.7 | smd 1.8 x 1.4: CD1 -2.05,0.4; CD2 -7.75,0.4 | smd 1.4 x 1.9: GND1 -13.6,14.55; GND3 -0.45,13.55
ARDUINO-MEGA = drill 0.8 octagon: 3V3 35.56,2.54; 5V 93.98,50.8; 5V-2 96.52,50.8; 5V-3 38.1,2.54; A0 50.8,2.54; A1 53.34,2.54; A2 55.88,2.54; A3 58.42,2.54; A4 60.96,2.54; A5 63.5,2.54; A6 66.04,2.54; A7 68.58,2.54; A8 73.66,2.54; A9 76.2,2.54; A10 78.74,2.54; A11 81.28,2.54; A12 83.82,2.54; A13 86.36,2.54; A14 88.9,2.54; A15 91.44,2.54; AREF 24.13,50.8; D0 63.5,50.8; D1 60.96,50.8; D2 58.42,50.8; D3 55.88,50.8; D4 53.34,50.8; D5 50.8,50.8; D6 48.26,50.8; D7 45.72,50.8; D8 41.91,50.8; D9 39.37,50.8; D10 36.83,50.8; D11 34.29,50.8; D12 31.75,50.8; D13 29.21,50.8; D14 68.58,50.8; D15 71.12,50.8; D16 73.66,50.8; D17 76.2,50.8; D18 78.74,50.8; D19 81.28,50.8; D20 83.82,50.8; D21 86.36,50.8; D22 93.98,48.26; D23 96.52,48.26; D24 93.98,45.72; D25 96.52,45.72; D26 93.98,43.18; D27 96.52,43.18; D28 93.98,40.64; D29 96.52,40.64; D30 93.98,38.1; D31 96.52,38.1; D32 93.98,35.56; D33 96.52,35.56; D34 93.98,33.02; D35 96.52,33.02; D36 93.98,30.48; D37 96.52,30.48; D38 93.98,27.94; D39 96.52,27.94; D40 93.98,25.4; D41 96.52,25.4; D42 93.98,22.86; D43 96.52,22.86; D44 93.98,20.32; D45 96.52,20.32; D46 93.98,17.78; D47 96.52,17.78; D48 93.98,15.24; D49 96.52,15.24; D50 93.98,12.7; D51 96.52,12.7; D52 93.98,10.16; D53 96.52,10.16; GND1 26.67,50.8; GND2 93.98,7.62; GND3 96.52,7.62; GND4 40.64,2.54; GND5 43.18,2.54; RESET 33.02,2.54; VIN 45.72,2.54
MSTBA2 = drill 1.397 long: 1 -2.54,5.08; 2 2.54,5.08

### Placement (x,y rotation side)
A  68.58,3.87 180 top
B  87,3.87 180 top
B1  5.99,59.64 0 top
C1  78.74,55.31 270 top
C2  88.9,55.31 270 top
C3  88.9,43.24 270 top
C4  78.74,30.54 270 top
C5  78.74,19.11 270 top
C6  88.9,19.11 270 top
C7  88.9,31.81 270 top
C8  78.74,43.24 90 top
C9  68.58,55.31 270 top
C11  22.86,48.32 0 top
C12  22.86,52.13 0 top
C13  22.86,55.94 0 top
D3  18.39,40.04 270 top
DOOR  84.45,56.48 270 top
ENCODER  16.51,52.13 90 top
F1  13.34,40.7 90 top
H1  98.42,9.59 0 top
H3  3.17,69.28 0 top
H8  3.17,9.59 180 top
H11  98.42,69.28 0 top
I2C  88.27,69.91 180 top
JP1  22.86,14.67 0 top
LCD  41.91,69.91 180 top
LED1  34.29,36.89 270 top
LED2  31.11,36.89 270 top
LED3  27.94,36.89 270 top
LEDS  51.44,47.58 180 top
LEDS1  64.14,43.24 270 top
MODULE1  31.55,39.55 270 top
Q1  3.06,49.96 0 top
Q3  49.53,32.45 270 top
Q4  49.53,19.75 270 top
Q7  19.05,8.32 180 top
Q8  13.97,8.32 180 top
Q9  8.89,8.32 180 top
Q10  35.56,8.32 180 top
Q11  30.48,8.32 180 top
Q12  25.4,8.32 180 top
Q13  53.98,8.32 180 top
Q14  48.9,8.32 180 top
Q15  43.81,8.32 180 top
Q16  72.39,8.32 180 top
Q17  67.31,8.32 180 top
Q18  62.23,8.32 180 top
Q19  90.81,8.32 180 top
Q20  85.72,8.32 180 top
Q21  80.64,8.32 180 top
R1  21.59,10.86 90 top
R3  16.51,10.86 90 top
R4  58.05,52.02 180 top
R5  47.9,52.02 180 top
R6  8.89,49.59 0 top
R7  22.86,46.42 0 top
R8  22.86,50.23 0 top
R10  19.05,10.86 0 top
R11  1.91,46.42 270 top
R12  34.29,33.72 270 top
R13  31.11,33.72 270 top
R14  27.94,33.72 270 top
R15  22.86,54.04 0 top
R16  13.97,10.86 0 top
R17  8.89,10.86 0 top
R19  46.99,32.45 90 top
R20  4.08,46.31 270 top
R21  47.62,34.99 0 top
R22  35.56,10.86 0 top
R23  46.99,19.75 90 top
R24  30.48,10.86 0 top
R25  25.4,10.86 0 top
R26  47.62,22.29 0 top
R29  53.98,10.86 0 top
R30  48.9,10.86 0 top
R31  43.81,10.86 0 top
R32  52.98,52.02 180 top
R37  72.39,10.86 0 top
R38  67.31,10.86 0 top
R39  62.23,10.86 0 top
R43  90.81,10.86 0 top
R44  85.72,10.86 0 top
R45  80.64,10.86 0 top
R46  11.43,10.86 90 top
R47  38.1,10.86 90 top
R48  33.02,10.86 90 top
R49  27.94,10.86 90 top
R50  46.35,10.86 90 top
R51  51.44,10.86 90 top
R52  56.52,10.86 90 top
R53  83.19,10.86 90 top
R54  64.77,10.86 90 top
R55  69.85,10.86 90 top
R56  74.93,10.86 90 top
R57  93.34,10.86 90 top
R58  88.27,10.86 90 top
R59  55.52,52.02 180 top
R60  50.44,52.02 180 top
R61  45.35,52.02 180 top
S1  14.61,32.45 0 top
SPI  64.14,26.1 270 top
SPINDLE  53.98,22.29 270 top
T1  51.7,56.47 0 top
T2  56.78,56.47 0 top
T3  46.62,56.47 0 top
TACH  74.3,56.48 270 top
TOOLZERO  64.14,56.48 270 top
U16  17.4,28.54 90 top
U$1  0,12.76 0 top
U$12  [OSHW_FILLX200_NOTEXT]  13.34,61.02 0 top
UART1  73.66,69.91 180 top
UART2  59.05,69.91 180 top
VACUUM  53.98,34.99 270 top
X  13.34,3.87 180 top
X1  2.15,37.65 270 top
XMAX  74.3,22.19 270 top
XMIN  84.45,22.19 270 top
Y  31.75,3.87 180 top
YMAX  74.3,33.62 270 top
YMIN  84.45,33.62 270 top
Z  50.16,3.87 180 top
ZMAX  84.45,45.05 270 top
ZMIN  74.3,45.05 270 top

### Tracks (layer width: path | path; a pad name or v marks a point on that pad's centre or on a via)
3.3V
  Top 0.254: 27.94,22.92 27.94,19.87 22.86,14.79 JP1.1 | 27.94,22.92 R14.2 | 27.94,22.92 U$1.3V3
5V
  Top 0.254: A.5 65.53,3.87 66.8,2.6 68.58,2.6 | A.3 68.58,2.6 | 68.58,2.6 72.9,2.6 74.17,3.87 A.1 78.99,3.87 80.26,2.6 85.34,2.6 | B.5 84.07,3.87 85.34,2.6 | 86.87,2.6 85.34,2.6 | 86.87,2.6 88.14,3.87 B.3 | B.1 92.46,3.87 91.19,2.6 86.87,2.6 | U$1.5V-3 38.1,19.87 39.12,20.89 39.12,28 38.35,28.76 37.08,28.76 33.02,32.83 31.24,32.83 R13.2 | X.1 23.62,3.87 24.89,2.6 26.67,2.6 Y.5
  Bottom 0.254: 13.21,5.14 14.48,3.87 X.3 | 13.21,5.14 9.65,8.7 | 9.65,8.7 4.57,13.78 4.57,53.4 9.65,58.48 9.65,59.5 B1.+ | 9.65,8.7 9.65,3.87 X.5 | X.1 18.8,3.87 17.53,5.14 13.21,5.14 | JP1.3 27.94,8.95 | 27.94,8.95 Y.5 | 27.94,8.95 Y.3 38.1,8.95 | U$1.5V-3 38.1,12 | 38.1,12 38.1,8.95 | 38.1,8.95 38.1,3.87 Y.1 | 38.1,12 44.96,5.14 | 44.96,5.14 46.23,3.87 Z.5 | Z.3 50.55,3.87 49.28,5.14 | 44.96,5.14 49.28,5.14 | Z.1 55.63,3.87 54.36,5.14 | 49.28,5.14 54.36,5.14 | A.5 64.01,3.87 62.74,5.14 54.36,5.14
+12V  (via drill 0.51)
  Top 0.508: LEDS.1 55.37,47.56 63.5,47.56 64.01,47.05 LEDS1.1 | 37.72,30.41 39.88,28.26 39.88,19.87 MODULE1.OUT+ | 37.72,30.41 35.31,32.83 34.29,32.83 R12.2 | v38.1,30.54 37.85,30.54 37.72,30.41
  Bottom 0.508: U$1.VIN 44.96,15.3 40.64,19.62 40.13,19.62 MODULE1.OUT+ | v38.1,30.54 55.12,47.56 LEDS.1
+24V  (via drill 0.51)
  Top 0.508: v23.11,42.48 17.27,42.48 D3.C
  Bottom 0.508: v23.11,42.48 39.88,59.24 MODULE1.IN+
ADIR  (via drill 0.51)
  Top 0.254: v70.87,12.76 69.85,11.75 R55.2
  Bottom 0.254: v70.87,12.76 91.44,12.76 98.81,20.13 98.81,33.34 U$1.D43
ADIROUT
  Top 0.254: A.4 Q17.3
AENABLE  (via drill 0.51)
  Top 0.254: R54.2 64.77,17.33 62.99,19.11 62.99,22.92 63.75,23.68 64.77,23.68 v70.36,29.27
  Bottom 0.254: v70.36,29.27 90.17,29.27 U$1.D44
AENABLEOUT
  Top 0.254: Q18.3 62.23,3.87 A.6
ASTEP  (via drill 0.51)
  Top 0.254: v88.9,17.08 83.82,17.08 82.55,15.81 82.55,14.79 79.5,11.75 74.93,11.75 R56.2
  Bottom 0.254: v88.9,17.08 93.47,21.65 97.03,21.65 97.79,22.41 97.79,28.51 97.03,29.27 96.01,29.27 95.25,30.03 95.25,34.35 U$1.D42
ASTEPOUT
  Top 0.254: A.2 Q16.3
BDIR
  Top 0.254: U$1.D46 92.71,29.27 92.71,14.79 89.66,11.75 88.39,11.75 R58.2
BDIROUT
  Top 0.254: Q20.3 85.85,7.17 85.85,3.87 B.4
BENABLE  (via drill 0.51)
  Top 0.254: v85.34,13.78 83.31,11.75 R53.2
  Bottom 0.254: v85.34,13.78 91.69,13.78 98.3,20.38 98.3,28.76 U$1.D47
BENABLEOUT
  Top 0.254: Q21.3 80.77,7.17 80.77,3.87 B.6
BLUE
  Top 0.254: U$1.D8 41.91,54.16 43.94,52.13 44.45,52.13 R61.2
BLUEOUT  (via drill 0.51)
  Top 0.254: v43.94,53.4 45.72,53.4 46.48,54.16 46.48,54.67 T3.2 | LEDS1.4 64.01,39.69 55.63,39.69 47.75,47.56 LEDS.4
  Bottom 0.254: v43.94,53.4 43.94,51.37 47.5,47.81 LEDS.4
BSTEP
  Top 0.254: U$1.D45 98.81,30.8 98.81,16.83 98.04,16.06 97.79,16.06 93.47,11.75 R57.2
BSTEPOUT
  Top 0.254: Q19.3 90.93,7.17 90.93,3.87 B.2
BUZZER  (via drill 0.51)
  Top 0.254: v11.18,44.77 3.56,44.77 2.79,45.53 2.03,45.53 R11.2
  Bottom 0.254: v11.18,44.77 16,49.59 27.94,49.59 40.64,62.29 42.67,62.29 45.21,64.83 49.53,64.83 U$1.D5
DOOR
  Top 0.254: DOOR.3 84.58,54.16 84.84,54.42 88.9,54.42 C2.2 88.9,54.67 91.44,57.21 94.49,57.21 95.76,58.48 U$1.D25
ENC_A_PIN  (via drill 0.51)
  Top 0.254: 21.84,50.86 21.84,52.13 C12.1 | 21.84,50.86 21.84,50.35 R8.1 21.84,50.86 | ENCODER.2 21.84,50.86 | v65.02,65.09 56.9,65.09 56.64,65.34 v40.39,65.34
  Bottom 0.254: U$1.D14 66.55,63.56 v65.02,65.09 | v40.39,65.34 36.83,65.34 35.56,64.07 35.56,63.05 23.37,50.86 ENCODER.2
ENC_B_PIN  (via drill 0.51)
  Top 0.254: C13.1 21.84,55.94 21.84,54.16 R15.1 21.84,53.91 17.02,53.91 16.51,53.4 ENCODER.3 | U$1.D15 71.12,65.09 v64.77,71.44
  Bottom 0.254: v64.77,71.44 64.26,71.44 63.75,71.94 52.07,71.94 48.26,68.13 37.08,68.13 33.02,64.07 33.02,63.05 23.37,53.4 16.51,53.4 ENCODER.3
GND
  Top 0.508: UART1.4 70.61,69.91 71.88,71.18 83.06,71.18 84.33,69.91 I2C.4 | LCD.1 UART2.4 | C2.1 88.9,56.2 84.84,56.2 84.58,56.45 DOOR.2 84.33,56.45 78.99,56.45 78.74,56.2 | 68.58,56.2 64.52,56.2 64.26,56.45 TOOLZERO.2 | 78.74,56.2 74.68,56.2 74.42,56.45 TACH.2 74.42,56.2 68.58,56.2 | 68.58,56.2 C9.1 | 78.74,56.2 C1.1 | C7.1 88.9,32.57 85.6,32.57 84.58,33.59 YMIN.2 84.33,33.59 78.74,33.59 | C4.1 78.74,31.3 76.71,31.3 74.42,33.59 YMAX.2 74.68,33.59 78.74,33.59 | C3.1 88.9,44 85.6,44 84.58,45.02 ZMAX.2 | ZMIN.2 74.42,45.02 76.71,42.73 78.74,42.73 C8.1 78.74,33.59 | U$1.GND3 U$1.GND2 93.98,14.79 90.17,10.98 R43.1 89.92,10.73 89.92,9.46 Q19.2 89.66,9.21 88.14,9.21 87.12,8.19 83.82,8.19 83.69,8.32 | Q21.2 79.76,9.46 79.76,10.73 R45.1 | R44.1 84.84,10.73 84.84,9.46 Q20.2 84.58,9.21 83.69,8.32 | 83.69,8.32 83.57,8.19 80.77,8.19 79.76,9.21 Q21.2 | 43.18,13.78 U$1.GND5 U$1.GND4 | 43.18,13.78 43.18,10.98 R31.1 42.93,10.73 42.93,9.46 Q15.2 42.67,9.21 38.1,9.21 37.08,8.19 32.26,8.19 32.13,8.32 | R29.1 53.09,10.73 53.09,9.46 Q13.2 52.83,9.21 51.31,9.21 50.29,8.19 49.02,8.19 48.01,9.21 Q14.2 48.01,9.46 48.01,10.73 R30.1 48.26,10.98 48.26,13.78 | 48.26,18.86 48.51,18.86 Q4.2 | 48.26,18.86 46.99,18.86 R23.1 | 48.26,18.86 48.26,13.78 | 48.26,18.86 Q4.2 | 48.26,13.78 43.18,13.78 | R19.1 46.99,31.56 48.51,31.56 Q3.2 | Q3.2 48.51,31.81 49.53,32.83 49.53,33.08 51.31,34.86 53.85,34.86 VACUUM.2 | R39.1 61.47,10.73 61.47,9.46 Q18.2 61.47,9.21 62.48,8.19 65.28,8.19 65.41,8.32 | R38.1 66.55,10.73 66.55,9.46 Q17.2 66.29,9.21 65.41,8.32 | 68.96,8.32 68.83,8.19 65.53,8.19 65.41,8.32 | 68.96,8.32 69.85,9.21 71.37,9.21 Q16.2 71.63,9.46 71.63,10.73 R37.1 71.88,10.98 71.88,19.87
  Top 0.508: C6.1 88.9,19.87 86.87,19.87 84.58,22.16 XMIN.2 84.33,22.16 74.68,22.16 XMAX.2 | C5.1 78.74,19.87 76.71,19.87 74.42,22.16 XMAX.2 | 71.88,19.87 64.26,19.87 SPI.6 | 71.88,19.87 74.17,22.16 XMAX.2 | 49.66,28.13 52.58,25.21 52.58,23.68 SPINDLE.2 | 49.66,28.13 48.77,29.02 48.77,31.3 Q3.2 | Q4.2 48.51,19.11 49.53,20.13 49.53,28 49.66,28.13 | Q21.2 79.5,9.21 74.93,9.21 73.91,8.19 69.09,8.19 68.96,8.32 | U16.CD1 17.02,26.48 17.02,20.89 U16.CD2 16.76,20.64 11.56,15.43 | Q9.2 8.13,9.46 8.13,10.73 R17.1 7.87,10.73 7.37,11.24 | 3.94,14.67 3.81,14.79 3.05,14.79 U16.GND1 | 3.94,14.67 7.37,11.24 | 7.37,11.24 11.56,15.43 | R22.1 34.8,10.73 34.8,9.46 Q10.2 34.54,9.21 33.02,9.21 32.13,8.32 | R24.1 29.72,10.73 29.72,9.46 Q11.2 29.46,9.21 28.57,8.32 | 28.57,8.32 28.45,8.19 25.65,8.19 24.64,9.21 Q12.2 24.64,9.46 24.64,10.73 R25.1 24.38,10.73 20.57,14.54 | 32.13,8.32 32,8.19 28.7,8.19 28.57,8.32 | 20.57,14.54 18.54,12.51 18.54,10.98 R10.1 18.29,10.73 18.29,9.46 Q7.2 18.03,9.21 17.02,8.19 14.22,8.19 13.21,9.21 Q8.2 13.21,9.46 13.21,10.73 R16.1 13.46,10.98 13.46,13.52 11.56,15.43 | 20.57,14.54 23.11,17.08 23.11,19.62 MODULE1.OUT- | 4.19,26.6 4.06,26.73 4.06,28 U16.GND3 4.06,28.26 10.16,34.35 | 4.19,26.6 5.59,25.21 6.35,25.21 U16.6 | LED1.C 34.29,37.91 31.24,37.91 LED2.C 30.99,37.91 27.94,37.91 LED3.C 27.94,37.65 25.02,37.65 | 10.16,34.35 7.87,34.35 7.37,34.86 X1.2 | 10.16,34.35 S1.1 S1.2 21.72,34.35 25.02,37.65 | 25.02,37.65 24.89,37.65 24.89,49.08 24.77,49.21 | R20.1 4.06,47.31 4.06,48.83 Q1.2 4.32,48.83 5.59,48.83 R6.A | ENCODER.4 ENCODER.5 16.51,58.48 | 16.51,58.48 10.41,64.58 10.41,69.91 LCD.16
  Top 0.508: 53.21,51.5 52.58,50.86 49.28,50.86 48.9,51.24 | 53.21,51.5 53.59,51.88 R32.1 | 48.9,51.24 48.77,51.37 48.77,51.88 R5.1 48.51,52.13 48.51,54.16 48.26,54.42 T3.3 48.26,54.67 48.26,57.21 50.8,59.75 52.58,59.75 52.7,59.62 | 53.21,51.5 54.86,49.85 56.64,49.85 58.67,51.88 R4.1 | 52.7,59.62 53.34,58.99 53.34,54.67 T1.3 | T2.3 58.42,54.67 58.42,58.99 57.66,59.75 52.83,59.75 52.7,59.62 | 24.77,49.21 24.89,49.34 24.89,49.59 | 24.77,49.21 23.88,48.32 C11.2 | 24.89,49.59 24.89,51.12 23.88,52.13 C12.2 24.13,52.13 24.89,52.89 24.89,54.93 23.88,55.94 C13.2 23.62,55.94 23.62,58.48 | 23.62,58.48 23.62,58.99 23.37,59.24 MODULE1.IN- 23.37,59.5 26.67,62.8 U$1.GND1 | 24.89,49.59 46.48,49.59 48.01,51.12 48.77,51.12 48.9,51.24 | 23.62,58.48 16.51,58.48 | 3.94,14.67 4.06,14.79 4.06,26.48 4.19,26.6
  Bottom 0.508: LCD.5 38.61,69.91 39.88,71.18 46.74,71.18 48.01,69.91 LCD.1 | UART1.4 64.77,69.91 63.5,71.18 56.64,71.18 55.37,69.91 UART2.4 55.63,69.91 55.63,65.59 57.15,64.07 57.15,63.05 63.5,56.7 64.01,56.7 TOOLZERO.2 | 83.06,45.27 74.42,45.27 ZMIN.2 74.17,45.02 71.63,45.02 61.72,35.11 54.1,35.11 VACUUM.2 | 83.06,45.27 84.33,45.27 ZMAX.2 | 83.06,45.27 83.06,54.42 84.33,55.69 84.33,56.45 DOOR.2 | SPINDLE.2 54.1,22.16 61.72,22.16 64.01,19.87 SPI.6 | R6.A 9.65,49.59 15.75,55.69 16.51,55.69 ENCODER.4
  pour Top: -2.54,76.26 104.14,76.26 104.14,-5.02 -2.54,-5.02
  pour Bottom: -2.54,76.26 104.14,76.26 104.14,-5.02 -2.54,-5.02
GREEN  (via drill 0.51)
  Top 0.254: v55.63,50.86 55.63,51.12 54.86,51.88 R59.2
  Bottom 0.254: v55.63,50.86 55.63,62.04 54.61,63.05 54.61,64.07 53.85,64.83 52.83,64.83 52.07,64.07 52.07,63.05 51.31,62.29 49.53,62.29 U$1.D6
GREENOUT  (via drill 0.51)
  Top 0.254: v59.44,53.4 57.66,53.4 56.9,54.16 56.9,54.67 T2.2
  Bottom 0.254: 59.44,49.08 v59.44,53.4 | 59.44,49.08 64.01,44.51 LEDS1.2 | 59.44,49.08 54.86,49.08 53.59,47.81 52.83,47.81 LEDS.2
LCD_D4
  Top 0.254: U$1.D23 95.76,61.02 94.49,59.75 86.87,59.75 84.84,57.72 62.48,57.72 57.15,63.05 57.15,64.07 56.39,64.83 41.4,64.83 40.64,64.07 40.64,63.05 39.88,62.29 36.32,62.29 35.56,63.05 35.56,64.07 30.99,68.64 24.38,68.64 23.11,69.91 LCD.11
LCD_D5  (via drill 0.51)
  Top 0.254: v62.23,66.61 44.7,66.61 41.91,69.4 41.91,70.42 41.15,71.18 21.84,71.18 20.57,69.91 LCD.12
  Bottom 0.254: U$1.D22 67.82,61.02 v62.23,66.61
LCD_D6
  Bottom 0.254: U$1.D12 30.99,63.56 25.91,68.64 19.3,68.64 18.03,69.91 LCD.13
LCD_D7
  Top 0.254: U$1.D11 33.53,63.56 28.96,68.13 17.27,68.13 15.49,69.91 LCD.14
LCD_EN
  Top 0.254: U$1.D10 36.83,68.9 35.81,69.91 LCD.6
LCD_RS
  Top 0.254: U$1.D9 39.37,68.64 LCD.4
MISO  (via drill 0.51)
  Top 0.254: v13.21,25.97 6.86,25.97 U16.7
  Bottom 0.254: v13.21,25.97 62.74,25.97 SPI.3 64.26,27.24 83.57,27.24 85.34,25.46 U$1.D50
MOSI  (via drill 0.51)
  Top 0.254: v15.49,26.99 10.41,21.91 6.86,21.91 U16.3
  Bottom 0.254: v15.49,26.99 26.42,26.99 26.67,26.73 60.96,26.73 SPI.2 65.79,28.26 83.31,28.26 84.84,26.73 94.49,26.73 95.76,25.46 U$1.D51
N$1
  Bottom 0.254: R6.S 8.89,56.96 16.51,64.58 16.51,70.42 17.27,71.18 36.07,71.18 36.83,70.42 36.83,69.4 37.59,68.64 41.91,68.64 LCD.3
N$5
  Top 0.254: 36.32,10.22 36.32,10.73 R22.2 | 36.32,10.22 36.32,9.46 Q10.1 | 36.32,10.22 38.1,10.22 R47.1
N$10
  Top 0.254: 46.99,33.34 46.99,34.86 R21.1 | 46.99,33.34 48.51,33.34 Q3.1 | 46.99,33.34 R19.2
N$11
  Top 0.254: 46.99,20.64 46.99,22.16 R26.1 | 46.99,20.64 48.51,20.64 Q4.1 | 46.99,20.64 R23.2
N$12
  Top 0.254: Q3.3 50.8,32.57 53.85,32.57 VACUUM.3
N$13
  Top 0.254: Q4.3 50.8,19.87 53.85,19.87 SPINDLE.3
N$18
  Top 0.254: 91.69,10.22 91.69,10.73 R43.2 | 91.69,10.22 91.69,9.46 Q19.1 | 91.69,10.22 93.22,10.22 R57.1
N$19
  Top 0.254: 86.61,10.22 86.61,10.73 R44.2 | 86.61,10.22 86.61,9.46 Q20.1 | 86.61,10.22 88.14,10.22 R58.1
N$20
  Top 0.254: 81.53,10.22 81.53,10.73 R45.2 | 81.53,10.22 81.53,9.46 Q21.1 | 81.53,10.22 83.06,10.22 R53.1
N$21
  Top 0.254: 73.15,10.22 73.15,10.73 R37.2 | 73.15,10.22 73.15,9.46 Q16.1 | 73.15,10.22 74.93,10.22 R56.1
N$22
  Top 0.254: 68.07,10.22 68.07,10.73 R38.2 | 68.07,10.22 68.07,9.46 Q17.1 | 68.07,10.22 69.85,10.22 R55.1
N$23
  Top 0.254: 62.99,10.22 62.99,10.73 R39.2 | 62.99,10.22 62.99,9.46 Q18.1 | 62.99,10.22 64.77,10.22 R54.1
N$24
  Top 0.254: 31.24,10.22 31.24,10.73 R24.2 | 31.24,10.22 31.24,9.46 Q11.1 | 31.24,10.22 33.02,10.22 R48.1
N$25
  Top 0.254: 2.03,47.81 2.03,48.83 Q1.1 | 2.03,47.81 2.03,47.31 R11.1 | 2.03,47.81 4.06,45.78 R20.2
N$26  (via drill 0.51)
  Top 0.254: v14.22,30.54 S1.3 | S1.4 v18.8,30.54 22.61,26.73 v22.61,24.19
  Bottom 0.254: v18.8,30.54 v14.22,30.54 | U$1.RESET 31.5,15.3 v22.61,24.19
N$27
  Top 0.254: LED1.A R12.1
N$28
  Top 0.508: D3.A 17.02,37.91 17.02,38.42 13.46,41.97 F1.P$2
N$29
  Top 0.254: 26.16,10.22 26.16,10.73 R25.2 | 26.16,10.22 26.16,9.46 Q12.1 | 26.16,10.22 27.94,10.22 R49.1
N$30
  Top 0.254: 44.7,10.22 44.7,10.73 R31.2 | 44.7,10.22 44.7,9.46 Q15.1 | 44.7,10.22 46.23,10.22 R50.1
N$31
  Top 0.254: 49.78,10.22 49.78,10.73 R30.2 | 49.78,10.22 49.78,9.46 Q14.1 | 49.78,10.22 51.31,10.22 R51.1
N$32
  Top 0.254: R13.1 31.24,34.61 31.24,35.88 LED2.A
N$33
  Top 0.254: LED3.A R14.1
N$35
  Top 0.254: 54.86,10.22 54.86,10.73 R29.2 | 54.86,10.22 54.86,9.46 Q13.1 | 54.86,10.22 56.39,10.22 R52.1
N$37
  Top 0.254: R32.2 52.07,52.13 51.31,52.13 R60.1 51.05,52.13 51.05,53.4 50.04,54.42 T1.1
N$38
  Top 0.254: Q1.3 3.05,51.12 3.05,58.74 2.29,59.5 B1.-
N$43
  Top 0.254: R4.2 57.15,52.13 56.39,52.13 R59.1 56.13,52.13 56.13,53.4 55.12,54.42 T2.1
N$44  (via drill 0.51)
  Top 0.254: R5.2 46.99,52.13 46.23,52.13 R61.1 45.97,51.88 v45.97,50.61 | v43.94,54.67 44.96,54.67 T3.1
  Bottom 0.254: v45.97,50.61 45.97,52.64 v43.94,54.67
OK_PIN  (via drill 0.51)
  Top 0.254: 21.84,48.32 21.84,46.54 R7.1 | 21.84,48.32 16.51,48.32 ENCODER.1 | 21.84,48.32 C11.1 | v47.24,38.16 35.56,38.16 v25.91,47.81
  Bottom 0.254: U$1.D24 86.61,58.48 84.84,60.26 84.07,60.26 64.52,40.7 49.78,40.7 v47.24,38.16 | v25.91,47.81 17.02,47.81 16.51,48.32 ENCODER.1
PRE24
  Top 0.508: F1.P$1 9.14,38.16 7.37,39.94 X1.1
RED  (via drill 0.51)
  Top 0.254: v49.28,56.7 49.28,53.66 49.53,53.4 49.53,52.13 R60.2
  Bottom 0.254: v49.28,56.7 49.28,60.01 U$1.D7
REDOUT  (via drill 0.51)
  Top 0.254: v54.36,55.94 54.36,53.91 53.85,53.4 52.58,53.4 51.82,54.16 51.82,54.67 T1.2 | LEDS1.3 64.01,42.23 55.63,42.23 50.29,47.56 LEDS.3
  Bottom 0.254: v54.36,55.94 54.36,51.88 50.29,47.81 LEDS.3
RX1
  Top 0.254: UART1.2 U$1.D19
RX2
  Bottom 0.254: U$1.D17 75.44,63.56 70.36,68.64 61.72,68.64 60.45,69.91 UART2.2
SCK  (via drill 0.51)
  Top 0.254: v11.43,24.19 6.86,24.19 U16.5
  Bottom 0.254: v11.43,24.19 21.34,24.19 22.35,25.21 51.82,25.21 53.59,23.43 62.74,23.43 SPI.4 65.79,26.48 80.26,26.48 83.31,23.43 84.84,23.43 85.34,22.92 U$1.D52
SCL
  Top 0.254: U$1.D21 86.36,66.86 89.41,69.91 I2C.2
SD_SELECT  (via drill 0.51)
  Top 0.254: v10.41,20.64 7.11,20.64 U16.2 | v97.79,17.08 97.79,26.73 U$1.D49
  Bottom 0.254: v10.41,20.64 26.67,4.38 26.67,3.36 27.43,2.6 77.72,2.6 86.36,11.24 91.95,11.24 v97.79,17.08
SDA
  Top 0.254: U$1.D20 83.82,66.86 86.87,69.91 I2C.3
SPINDLE  (via drill 0.51)
  Top 0.254: v40.89,35.88 48.26,28.51 48.26,22.41 R26.2
  Bottom 0.254: v40.89,35.88 40.89,39.18 49.02,47.31 49.02,48.32 53.34,52.64 U$1.D4
SS  (via drill 0.51)
  Top 0.254: v86.11,24.19 85.6,24.19 84.84,23.43 65.28,23.43 SPI.5
  Bottom 0.254: U$1.D53 95.76,22.92 94.49,24.19 v86.11,24.19
TACHOMETER
  Top 0.254: C1.2 78.74,54.42 74.68,54.42 74.42,54.16 TACH.3
  Bottom 0.254: U$1.D2 58.42,63.05 63.75,57.72 70.61,57.72 74.17,54.16 TACH.3
TOOLZERO
  Top 0.254: 68.58,54.42 64.52,54.42 64.26,54.16 TOOLZERO.3 | U$1.D26 91.69,55.94 88.39,52.64 70.36,52.64 68.58,54.42 | 68.58,54.42 C9.2
TX1
  Top 0.254: U$1.D18 72.39,69.91 UART1.3
TX2
  Bottom 0.254: U$1.D16 72.9,63.56 68.33,68.13 59.69,68.13 57.91,69.91 UART2.3
VACUUM
  Top 0.254: U$1.D3 61.72,57.72 61.72,52.13 58.67,49.08 47.5,49.08 46.48,48.07 46.48,47.05 48.26,45.27 48.26,35.11 R21.2
VCC  (via drill 0.51)
  Top 0.254: v10.16,22.92 6.6,22.92 U16.4 | 22.86,49.34 22.86,47.31 23.62,46.54 R7.2 23.62,46.29 22.61,45.27 17.78,45.27 13.46,49.59 13.21,49.59 | 22.86,49.34 23.62,50.1 R8.2 | 22.86,49.34 22.86,53.15 23.62,53.91 R15.2 | 13.21,49.59 R6.E | 13.21,49.59 8.64,54.16 8.64,70.17 9.65,71.18 10.67,71.18 11.94,69.91 LCD.15 13.46,69.91 15.24,71.69 43.94,71.69 LCD.2 46.48,69.91 47.75,71.18 61.47,71.18 62.74,69.91 UART2.1 62.99,69.91 62.99,68.39 66.04,65.34 66.04,58.99 | 61.72,30.03 64.01,32.32 SPI.1 64.26,32.57 73.15,32.57 | 61.72,30.03 56.64,24.95 54.1,24.95 SPINDLE.1 | 61.72,30.03 61.47,30.03 54.1,37.4 VACUUM.1 | ZMAX.1 84.33,47.56 74.42,47.56 ZMIN.1 74.17,47.31 72.64,45.78 72.64,37.65 74.17,36.13 YMAX.1 74.17,35.88 73.15,34.86 73.15,32.57 | XMIN.1 84.33,24.45 74.42,24.45 XMAX.1 74.17,24.7 74.17,29.53 73.15,30.54 73.15,32.57 | 66.04,58.99 74.17,58.99 TACH.1 74.42,58.99 82.55,58.99 | 66.04,58.99 64.26,58.99 TOOLZERO.1 | 82.55,58.99 84.33,58.99 DOOR.1 84.58,58.99 91.95,66.36 91.95,69.91 I2C.1 | 82.55,58.99 82.55,64.07 77.47,69.15 77.47,69.91 UART1.1
  Bottom 0.254: JP1.2 25.4,14.79 17.27,22.92 v10.16,22.92 9.14,22.92 8.13,23.94 8.13,32.83 10.16,34.86 10.16,48.32 R6.E | YMAX.1 74.42,36.13 84.33,36.13 YMIN.1 | ZMIN.1 74.42,47.56 74.42,48.83 84.33,58.74 DOOR.1
XDIR  (via drill 0.51)
  Top 0.254: R3.2 16.51,16.83 26.92,27.24 v26.92,27.75 | v86.11,39.94 88.14,39.94 U$1.D34
  Bottom 0.254: v26.92,27.75 36.83,27.75 42.93,33.84 62.23,33.84 68.33,39.94 v86.11,39.94
XDIRIN
  Top 0.254: 14.73,10.22 14.73,10.73 R16.2 | 14.73,10.22 14.73,9.46 Q8.1 | 14.73,10.22 16.51,10.22 R3.1
XDIROUT
  Top 0.254: Q8.3 13.97,5.65 12.19,3.87 X.4
XENABLE  (via drill 0.51)
  Top 0.254: v12.45,12.76 11.43,11.75 R46.2 | v23.62,1.59 92.71,1.59 94.74,3.62 94.74,12 100.58,17.84 100.58,41.72 U$1.D35
  Bottom 0.254: v23.62,1.59 v12.45,12.76
XENABLEIN
  Top 0.254: 9.65,10.22 9.65,10.73 R17.2 | 9.65,10.22 9.65,9.46 Q9.1 | 9.65,10.22 11.43,10.22 R46.1
XENABLEOUT
  Top 0.254: Q9.3 8.89,5.65 7.11,3.87 X.6
XMAX  (via drill 0.51)
  Top 0.254: C5.2 78.74,18.6 75.44,18.6 74.42,19.62 XMAX.3 | U$1.D28 93.98,52.64 95.25,51.37 95.25,40.19 94.49,39.43 93.47,39.43 89.92,35.88 89.92,30.54 85.34,25.97 80.52,25.97 v80.01,25.46
  Bottom 0.254: v80.01,25.46 74.42,19.87 XMAX.3
XMIN  (via drill 0.51)
  Top 0.254: XMIN.3 84.58,19.62 85.6,18.6 88.9,18.6 C6.2 88.9,18.35 92.2,21.65 92.2,33.08 93.47,34.35 97.03,34.35 v98.55,35.88
  Bottom 0.254: U$1.D27 96.52,55.18 98.55,53.15 v98.55,35.88
XSTEP  (via drill 0.51)
  Top 0.254: v22.61,4.89 22.61,10.48 21.59,11.49 R1.2 | U$1.D33 v100.58,44.26
  Bottom 0.254: v22.61,4.89 25.4,2.09 93.22,2.09 94.74,3.62 94.74,12.76 100.58,18.6 v100.58,44.26
XSTEPIN
  Top 0.254: 19.81,10.22 19.81,10.73 R10.2 | 19.81,10.22 19.81,9.46 Q7.1 | 19.81,10.22 21.59,10.22 R1.1
XSTEPOUT
  Top 0.254: Q7.3 19.05,5.65 17.27,3.87 X.2
YDIR  (via drill 0.51)
  Top 0.254: v38.1,27.75 36.83,26.48 36.83,14.79 33.78,11.75 33.02,11.75 R48.2 | v88.9,37.4 v86.11,37.4
  Bottom 0.254: v38.1,27.75 57.66,27.75 65.02,35.11 71.63,35.11 73.91,37.4 v86.11,37.4 | v88.9,37.4 93.47,41.97 95.25,41.97 U$1.D37
YDIROUT
  Top 0.254: Y.4 Q11.3
YENABLE  (via drill 0.51)
  Top 0.254: R49.2 27.94,12.25 v32.51,16.83 | v46.74,28.76 v42.16,24.19 | v86.11,38.67 91.95,38.67 U$1.D38
  Bottom 0.254: v32.51,16.83 34.8,16.83 v42.16,24.19 | v46.74,28.76 57.91,28.76 67.82,38.67 v86.11,38.67
YENABLEOUT
  Top 0.254: Q12.3 25.4,3.87 Y.6
YMAX
  Top 0.254: C4.2 78.74,30.03 75.44,30.03 74.42,31.05 YMAX.3
  Bottom 0.254: U$1.D30 90.17,50.86 87.12,47.81 87.12,34.61 84.84,32.32 75.44,32.32 74.42,31.3 YMAX.3
YMIN
  Top 0.254: C7.2 88.9,31.05 84.58,31.05 YMIN.3
  Bottom 0.254: U$1.D29 96.52,52.64 95.25,51.37 95.25,50.35 94.49,49.59 91.19,49.59 90.93,49.85 90.42,49.85 87.63,47.05 87.63,34.35 84.58,31.3 YMIN.3
YSTEP  (via drill 0.51)
  Top 0.254: v41.91,11.75 38.1,11.75 R47.2 | v56.13,21.14 63.75,28.76 67.82,28.76 v70.61,31.56 | v88.9,34.86 v86.11,34.86
  Bottom 0.254: v41.91,11.75 44.2,11.75 53.59,21.14 v56.13,21.14 | v70.61,31.56 73.91,34.86 v86.11,34.86 | v88.9,34.86 93.47,39.43 97.03,39.43 97.79,40.19 97.79,43.75 97.03,44.51 95.25,44.51 U$1.D36
YSTEPOUT
  Top 0.254: Y.2 Q10.3
ZDIR  (via drill 0.51)
  Top 0.254: v72.14,30.29 70.1,30.29 66.04,26.22 63.75,26.22 54.61,17.08 54.61,14.79 51.56,11.75 R51.2
  Bottom 0.254: v72.14,30.29 73.41,30.29 73.91,29.78 85.6,29.78 U$1.D40
ZDIROUT
  Top 0.254: Q14.3 49.02,7.17 49.02,3.87 Z.4
ZENABLE  (via drill 0.51)
  Top 0.254: v46.48,12.76 46.48,11.75 R50.2 | v88.39,21.91 88.39,28.26 91.69,31.56 91.69,35.11 93.47,36.89 95.25,36.89 U$1.D41
  Bottom 0.254: v46.48,12.76 52.07,18.35 84.84,18.35 v88.39,21.91
ZENABLEOUT
  Top 0.254: Q15.3 43.94,7.17 43.94,3.87 Z.6
ZMAX
  Top 0.254: 88.9,42.48 84.58,42.48 ZMAX.3 | U$1.D32 93.98,47.56 88.9,42.48 | 88.9,42.48 C3.2
ZMIN
  Top 0.254: 74.68,46.29 76.96,44 78.74,44 C8.2 | 74.68,46.29 73.91,46.29 73.15,45.53 73.15,43.75 74.17,42.73 ZMIN.3 | U$1.D31 96.52,51.62 95.25,52.89 95.25,53.91 94.49,54.67 93.47,54.67 91.69,52.89 91.69,48.58 89.41,46.29 74.68,46.29
ZSTEP  (via drill 0.51)
  Top 0.254: v60.45,11.75 56.64,11.75 R52.2 | U$1.D39 v99.57,37.65
  Bottom 0.254: v60.45,11.75 91.19,11.75 99.57,20.13 v99.57,37.65
ZSTEPOUT
  Top 0.254: Q13.3 54.1,7.17 54.1,3.87 Z.2

### Text on the board
tPlace: RevE | +++ | B | R | G | + | GND | RESET | Copyright 2014 | License: GPLv3 | By: Zach Hoeken | Hoektronics::CNC | 3.3V | 5V | X | B